# EAGLE design bytexplore_devboard (EAGLE 9.4.2)
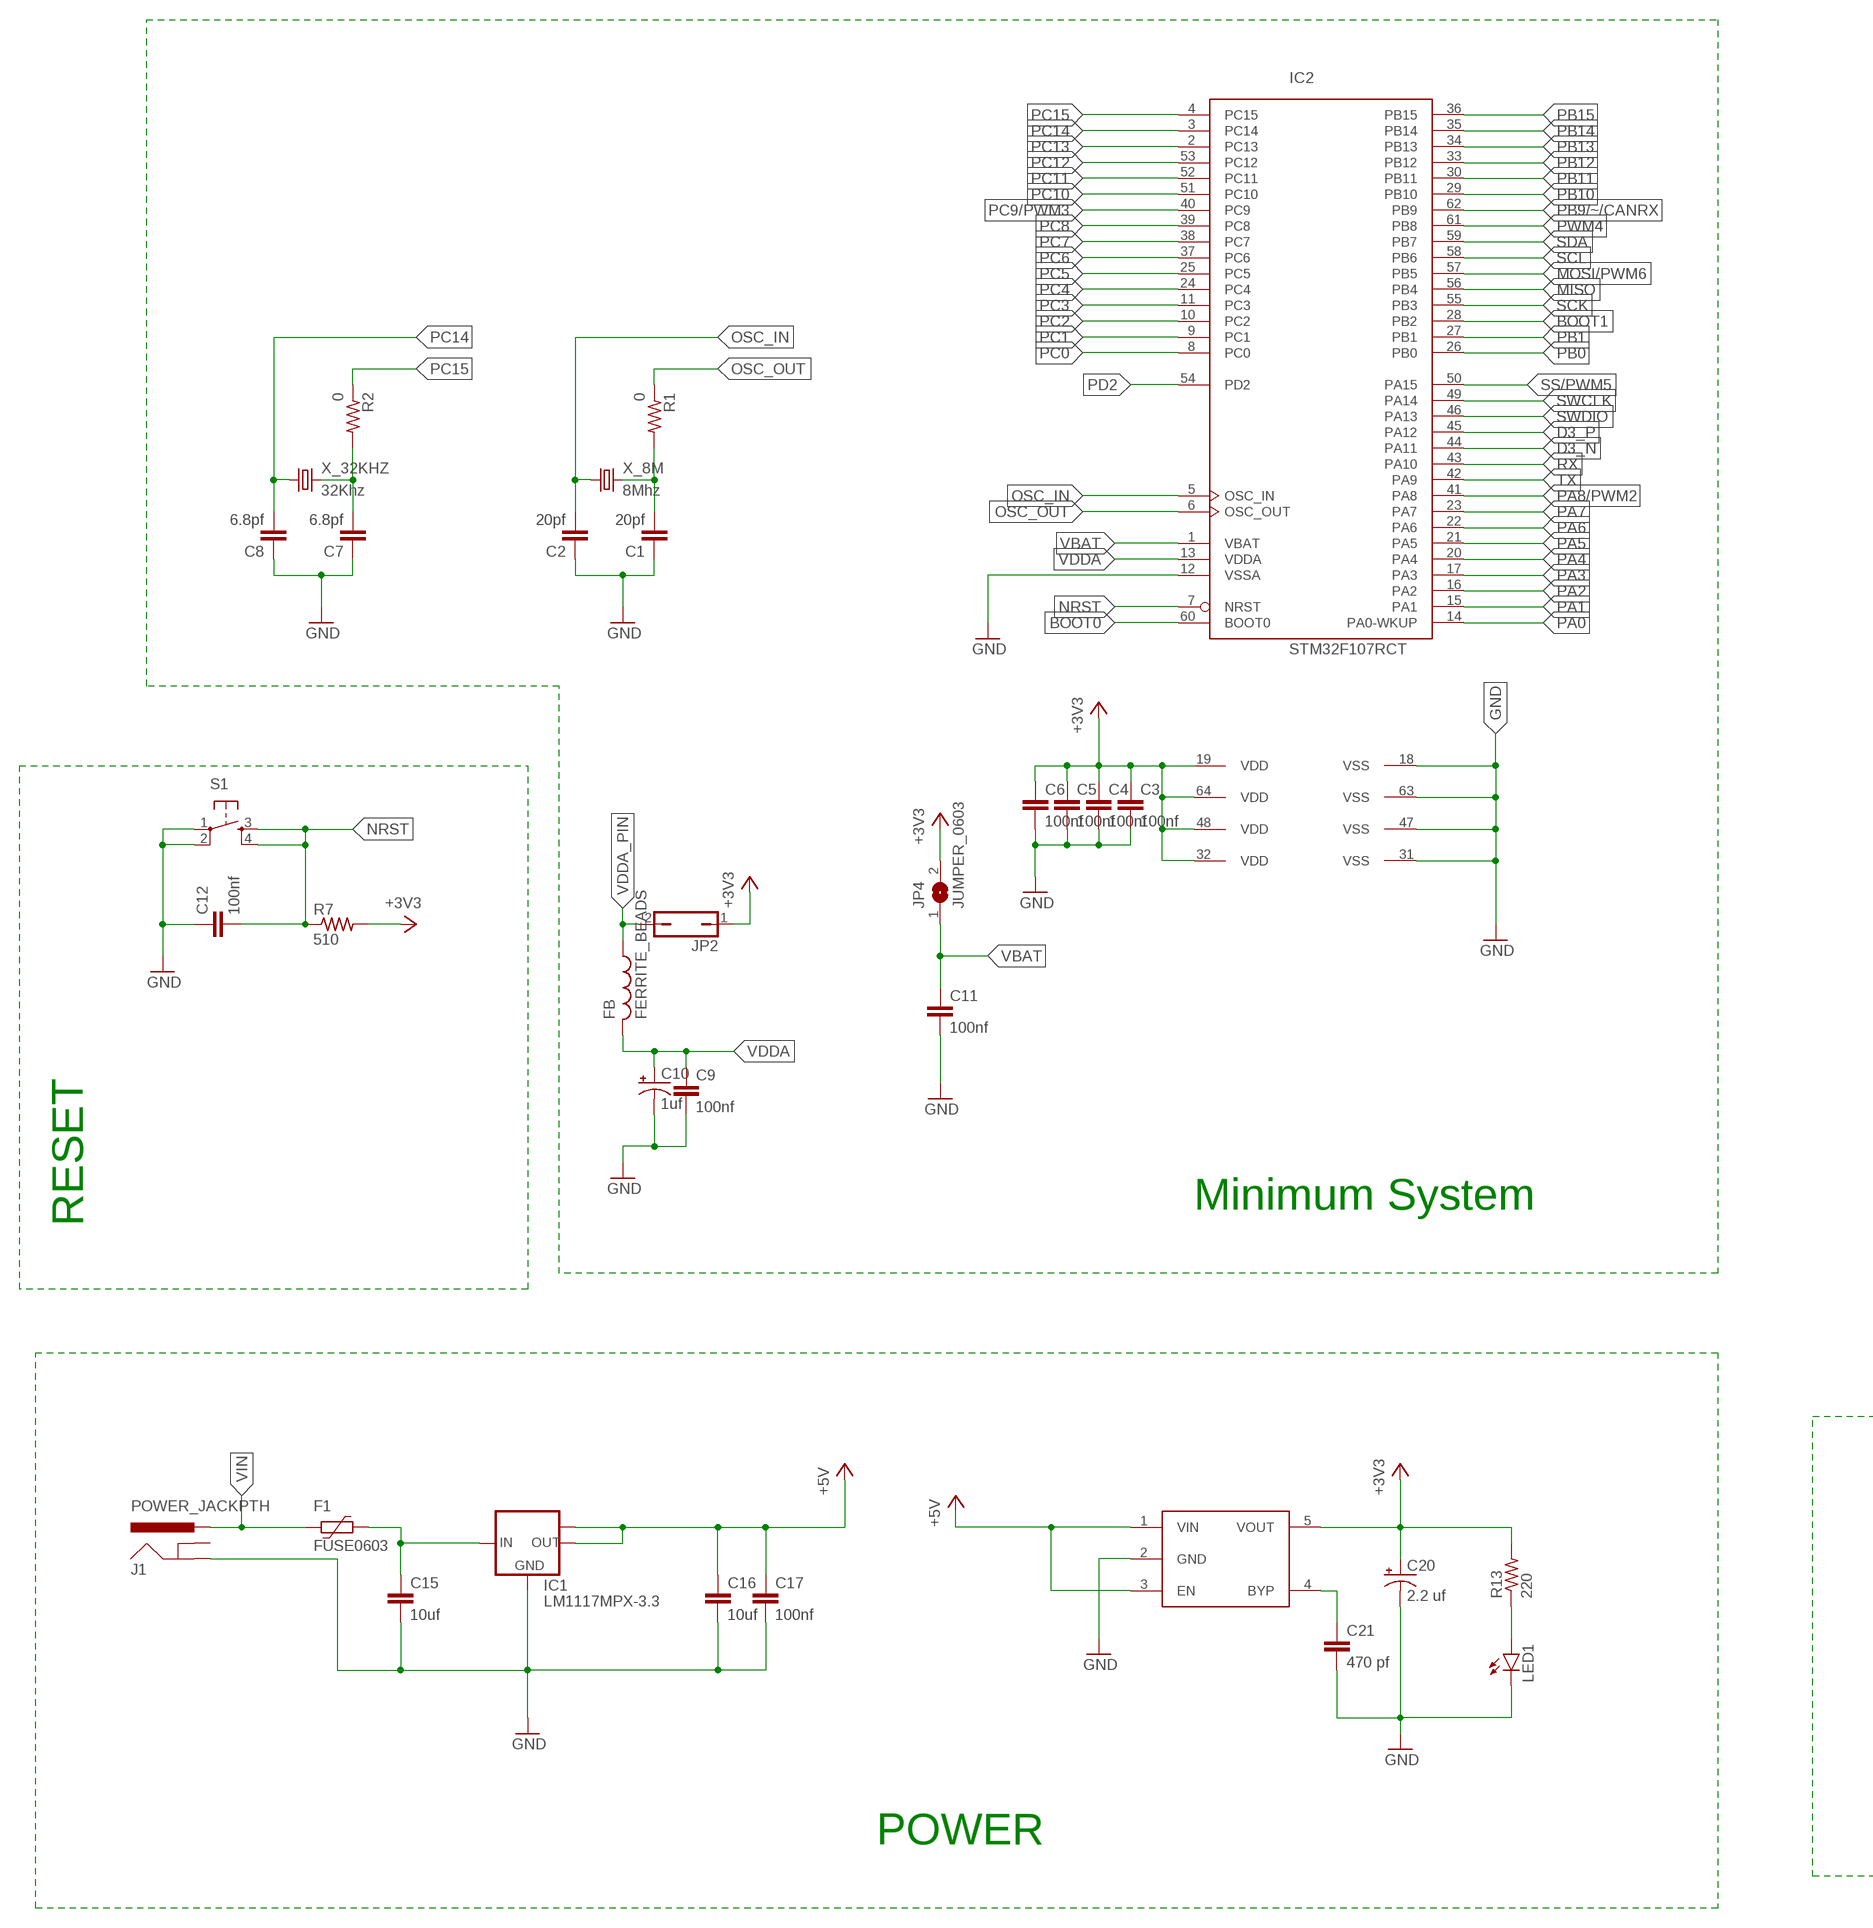
[diagram p0: schematic, sheet 1, part 1 of 2]
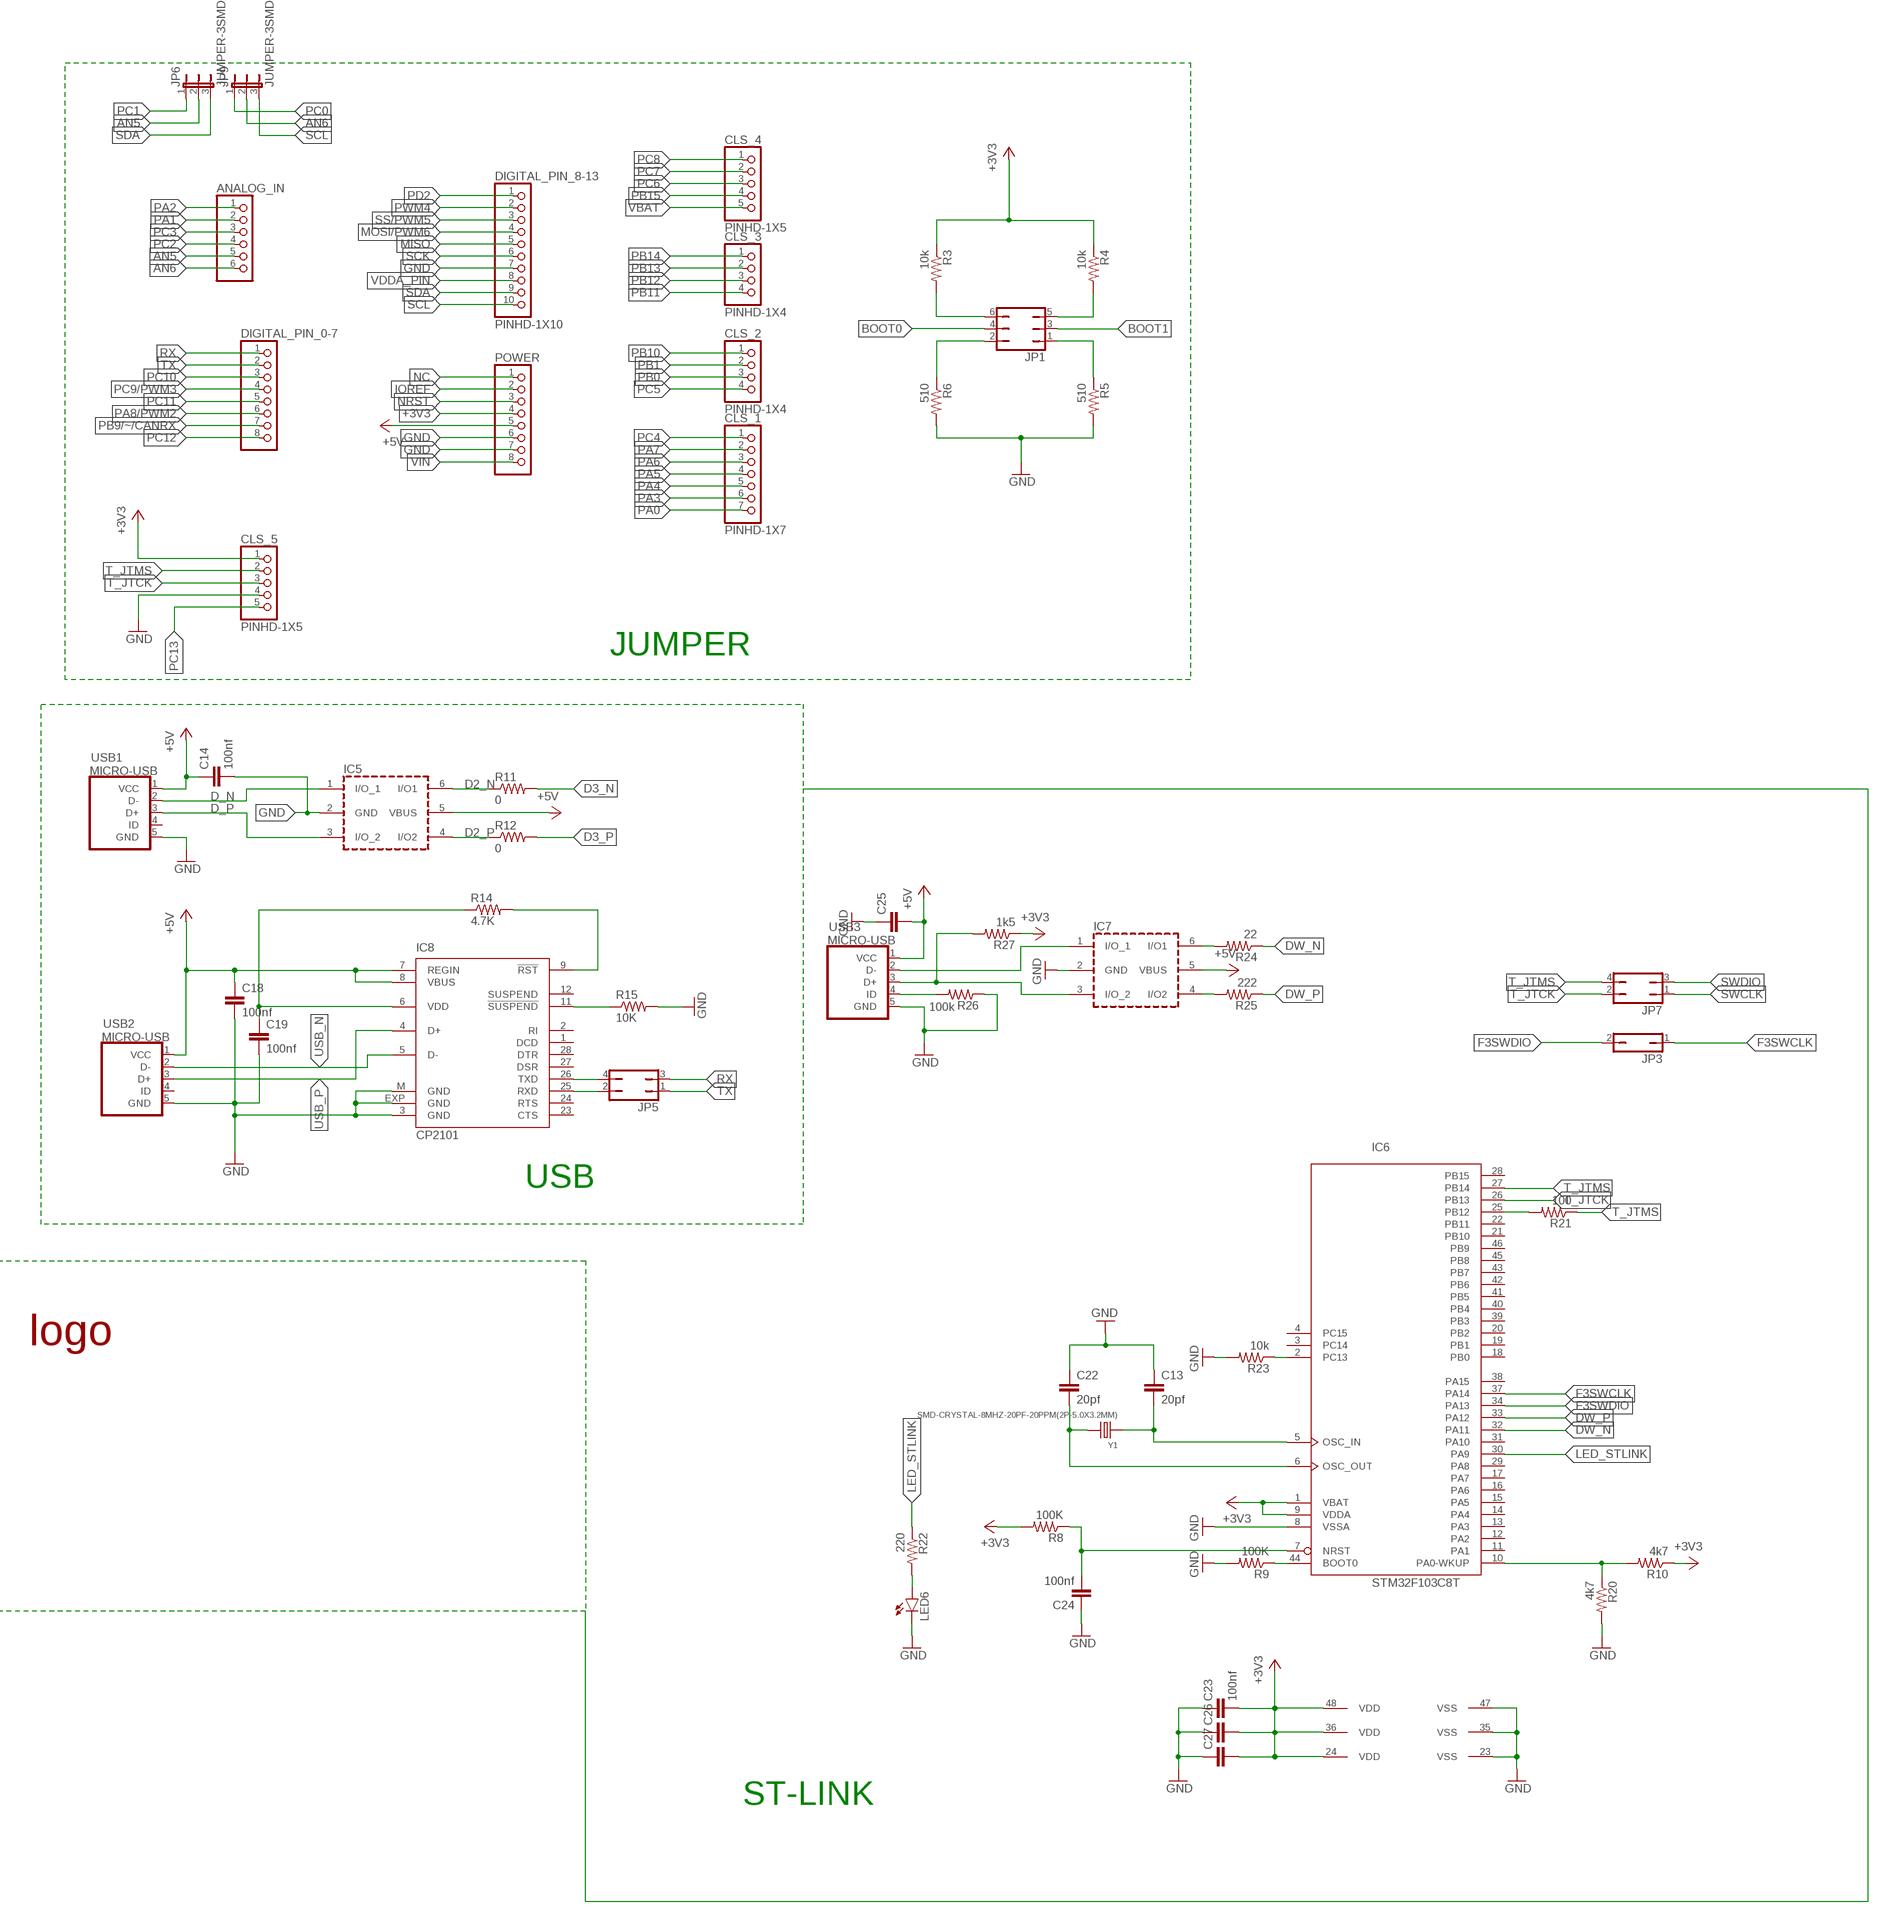
[diagram p1: schematic, sheet 1, part 2 of 2]

## Parts
ANALOG_IN  PINHD-1X6B  [1X06-BIG]
C1  20pf  C-EUC0603K  [C0603K]
C2  20pf  C-EUC0603K  [C0603K]
C3  100nf  C-EUC0603K  [C0603K]
C4  100nf  C-EUC0603K  [C0603K]
C5  100nf  C-EUC0603K  [C0603K]
C6  100nf  C-EUC0603K  [C0603K]
C7  6.8pf  C-EUC0603K  [C0603K]
C8  6.8pf  C-EUC0603K  [C0603K]
C9  100nf  C-EUC0603K  [C0603K]
C10  1uf  CPOL-USSMCB  [SMC_B]
C11  100nf  C-EUC0603K  [C0603K]
C12  100nf  C-EUC0603K  [C0603K]
C13  20pf  C-EUC0603  [C0603]
C14  100nf  C-EUC0603K  [C0603K]
C15  10uf  C-EUC0603  [C0603]
C16  10uf  C-EUC0603  [C0603]
C17  100nf  C-EUC0603  [C0603]
C18  100nf  C-EUC0603K  [C0603K]
C19  100nf  C-EUC0603K  [C0603K]
C20  2.2 uf  CPOL-USSMCA  [SMC_A]
C21  470 pf  C-EUC0603  [C0603]
C22  20pf  C-EUC0603  [C0603]
C23  100nf  C-EUC0603  [C0603]
C24  100nf  C-EUC0603  [C0603]
C25  C-EUC0603  [C0603]
C26  C-EUC0603  [C0603]
C27  C-EUC0603  [C0603]
CLS_1  PINHD-1X7  [1X07-BIG]
CLS_2  PINHD-1X4  [1X04-BIG]
CLS_3  PINHD-1X4  [1X04-BIG]
CLS_4  PINHD-1X5  [1X05-BIG]
CLS_5  PINHD-1X5  [1X05-BIG]
DIGITAL_PIN_0-7  PINHD-1X8BIG  [1X08-BIG]
DIGITAL_PIN_8-13  PINHD-1X10  [1X10-BIG]
F1  FUSE0603  [R0603]
FB  FERRITE_BEADS  [R0603]
IC1  LM1117MPX-3.3  [SOT223]
IC2  STM32F107RCT  [LQFP64]
IC4  MIC5219  [SOT-23-5]
IC5  USBLC6-2SC6  [SOT-23-6L]
IC6  STM32F103C8T  [LQFP48]
IC7  USBLC6-2SC6  [SOT-23-6L]
IC8  CP2101  [MLP28]
J1  POWER_JACKPTH  [POWER_JACK_PTH]
JP1  JP3Q  [JP3Q]
JP2  JP1Q  [JP1]
JP3  JP1Q  [JP1]
JP4  JUMPER_0603  [R0603]
JP5  JP2Q  [JP2Q]
JP6  JUMPER-3SMD  [SJ_3]
JP7  JP2Q  [JP2Q]
JP9  JUMPER-3SMD  [SJ_3]
LED1  LEDSML0603  [SML0603]
LED6  LEDSML0603  [SML0603]
POWER  PINHD-1X8BIG  [1X08-BIG]
R1  0  R-US_R0603  [R0603]
R2  0  R-US_R0603  [R0603]
R3  10k  R-US_R0603  [R0603]
R4  10k  R-US_R0603  [R0603]
R5  510  R-US_R0603  [R0603]
R6  510  R-US_R0603  [R0603]
R7  510  R-US_R0603  [R0603]
R8  100K  R-US_R0603  [R0603]
R9  100K  R-US_R0603  [R0603]
R10  4k7  R-US_R0603  [R0603]
R11  0  R-US_R0603  [R0603]
R12  0  R-US_R0603  [R0603]
R13  220  R-US_R0603  [R0603]
R14  4.7K  R-US_R0603  [R0603]
R15  10K  R-US_R0603  [R0603]
R20  4k7  R-US_R0603  [R0603]
R21  100  R-US_R0603  [R0603]
R22  220  R-US_R0603  [R0603]
R23  10k  R-US_R0603  [R0603]
R24  22  R-US_R0603  [R0603]
R25  222  R-US_R0603  [R0603]
R26  100k  R-US_R0603  [R0603]
R27  1k5  R-US_R0603  [R0603]
S1  TAC_SWITCHPTH  [TACTILE-PTH]
U$1  LOGO_PME2  [LOGO_PME2]
USB1  MICRO-USB  [MICRO-USB]
USB2  MICRO-USB  [MICRO-USB]
USB3  MICRO-USB  [MICRO-USB]
X_8M  8Mhz  CRYSTALHC49U70  [HC49U70]
X_32KHZ  32Khz  CRYSTALTC26H  [TC26H]
Y1  SMD-CRYSTAL-8MHZ-20PF-20PPM(2P-5.0X3.2MM)  [X2-SMD-5.0X3.2X1.3MM]

## Nets
+3V3: C3.1 C4.1 C5.1 C6.1 C20.+ C23.2 C26.2 C27.2 CLS_5.1 IC2.19(VDD) IC2.32(VDD) IC2.48(VDD) IC2.64(VDD) IC4.5(VOUT) IC6.1(VBAT) IC6.9(VDDA) IC6.24(VDD) IC6.36(VDD) IC6.48(VDD) JP2.1 JP4.2 POWER.4 R3.1 R4.1 R7.2 R8.2 R10.1 R13.2 R27.1
+5V: C14.1 C16.1 C17.1 C18.1 C25.2 IC1.2(OUT) IC1.TAB(OUT1) IC4.1(VIN) IC4.3(EN) IC5.5(VBUS) IC7.5(VBUS) IC8.7(REGIN) IC8.8(VBUS) POWER.5 USB1.1(VCC) USB2.1(VCC) USB3.1(VCC)
AN5: ANALOG_IN.5 JP6.2
AN6: ANALOG_IN.6 JP9.2
BOOT0: IC2.60(BOOT0) JP1.4
BOOT1: IC2.28(PB2) JP1.3
D2_N: IC5.6(I/O1) R11.1
D2_P: IC5.4(I/O2) R12.1
D3_N: IC2.44(PA11) R11.2
D3_P: IC2.45(PA12) R12.2
D_N: IC5.1(I/O_1) USB1.2(D-)
D_P: IC5.3(I/O_2) USB1.3(D+)
DW_N: IC6.32(PA11) R24.1
DW_P: IC6.33(PA12) R25.1
F3SWCLK: IC6.37(PA14) JP3.1
F3SWDIO: IC6.34(PA13) JP3.2
GND: C1.1 C2.1 C3.2 C4.2 C5.2 C6.2 C7.1 C8.1 C9.2 C10.- C11.2 C12.1 C13.1 C14.2 C15.2 C16.2 C17.2 C18.2 C19.2 C20.- C21.2 C22.1 C23.1 C24.1 C25.1 C26.1 C27.1 CLS_5.4 DIGITAL_PIN_8-13.7 IC1.1(GND) IC2.12(VSSA) IC2.18(VSS) IC2.31(VSS) IC2.47(VSS) IC2.63(VSS) IC4.2(GND) IC5.2(GND) IC6.8(VSSA) IC6.23(VSS) IC6.35(VSS) IC6.47(VSS) IC7.2(GND) IC8.3(GND) IC8.EXP(GND) IC8.M(GND) J1.GND LED1.C LED6.C POWER.6 POWER.7 R5.2 R6.2 R9.2 R15.2 R20.2 R23.2 R26.1 S1.1 S1.2 USB1.5(GND) USB2.5(GND) USB3.5(GND)
IOREF: POWER.2
LED_STLINK: IC6.30(PA9) R22.1
MISO: DIGITAL_PIN_8-13.5 IC2.56(PB4)
MOSI/PWM6: DIGITAL_PIN_8-13.4 IC2.57(PB5)
N$1: JP1.5 R4.2
N$2: C1.2 R1.2 X_8M.2
N$3: JP1.6 R3.2
N$4: C7.2 R2.2 X_32KHZ.2
N$5: C19.1 IC8.6(VDD) R14.1
N$6: C13.2 IC6.5(OSC_IN) Y1.1
N$7: C24.2 IC6.7(NRST) R8.1
N$8: C22.2 IC6.6(OSC_OUT) Y1.2
N$9: C15.1 F1.1 IC1.3(IN)
N$10: IC6.44(BOOT0) R9.1
N$11: LED1.A R13.1
N$12: IC6.10(PA0-WKUP) R10.2 R20.1
N$13: IC6.25(PB12) R21.2
N$14: LED6.A R22.2
N$15: IC6.2(PC13) R23.1
N$16: IC8.9(!RST) R14.2
N$17: IC8.11(!SUSPEND) R15.1
N$18: IC7.6(I/O1) R24.2
N$19: IC8.26(TXD) JP5.4
N$20: IC8.25(RXD) JP5.2
N$21: IC7.4(I/O2) R25.2
N$23: IC7.1(I/O_1) USB3.2(D-)
N$33: JP1.1 R5.1
N$34: JP1.2 R6.1
N$40: IC7.3(I/O_2) R27.2 USB3.3(D+)
N$45: R26.2 USB3.4(ID)
N$55: C21.1 IC4.4(BYP)
NC: POWER.1
NRST: C12.2 IC2.7(NRST) POWER.3 R7.1 S1.3 S1.4
OSC_IN: C2.2 IC2.5(OSC_IN) X_8M.1
OSC_OUT: IC2.6(OSC_OUT) R1.1
PA0: CLS_1.7 IC2.14(PA0-WKUP)
PA1: ANALOG_IN.2 IC2.15(PA1)
PA2: ANALOG_IN.1 IC2.16(PA2)
PA3: CLS_1.6 IC2.17(PA3)
PA4: CLS_1.5 IC2.20(PA4)
PA5: CLS_1.4 IC2.21(PA5)
PA6: CLS_1.3 IC2.22(PA6)
PA7: CLS_1.2 IC2.23(PA7)
PA8/PWM2: DIGITAL_PIN_0-7.6 IC2.41(PA8)
PB0: CLS_2.3 IC2.26(PB0)
PB1: CLS_2.2 IC2.27(PB1)
PB9/~/CANRX: DIGITAL_PIN_0-7.7 IC2.62(PB9)
PB10: CLS_2.1 IC2.29(PB10)
PB11: CLS_3.4 IC2.30(PB11)
PB12: CLS_3.3 IC2.33(PB12)
PB13: CLS_3.2 IC2.34(PB13)
PB14: CLS_3.1 IC2.35(PB14)
PB15: CLS_4.4 IC2.36(PB15)
PC0: IC2.8(PC0) JP9.1
PC1: IC2.9(PC1) JP6.1
PC2: ANALOG_IN.4 IC2.10(PC2)
PC3: ANALOG_IN.3 IC2.11(PC3)
PC4: CLS_1.1 IC2.24(PC4)
PC5: CLS_2.4 IC2.25(PC5)
PC6: CLS_4.3 IC2.37(PC6)
PC7: CLS_4.2 IC2.38(PC7)
PC8: CLS_4.1 IC2.39(PC8)
PC9/PWM3: DIGITAL_PIN_0-7.4 IC2.40(PC9)
PC10: DIGITAL_PIN_0-7.3 IC2.51(PC10)
PC11: DIGITAL_PIN_0-7.5 IC2.52(PC11)
PC12: DIGITAL_PIN_0-7.8 IC2.53(PC12)
PC13: CLS_5.5 IC2.2(PC13)
PC14: C8.2 IC2.3(PC14) X_32KHZ.1
PC15: IC2.4(PC15) R2.1
PD2: DIGITAL_PIN_8-13.1 IC2.54(PD2)
PWM4: DIGITAL_PIN_8-13.2 IC2.61(PB8)
RX: DIGITAL_PIN_0-7.1 IC2.43(PA10) JP5.3
SCK: DIGITAL_PIN_8-13.6 IC2.55(PB3)
SCL: DIGITAL_PIN_8-13.10 IC2.58(PB6) JP9.3
SDA: DIGITAL_PIN_8-13.9 IC2.59(PB7) JP6.3
SS/PWM5: DIGITAL_PIN_8-13.3 IC2.50(PA15)
SWCLK: IC2.49(PA14) JP7.1
SWDIO: IC2.46(PA13) JP7.3
T_JTCK: CLS_5.3 IC6.26(PB13) JP7.2
T_JTMS: CLS_5.2 IC6.27(PB14) JP7.4 R21.1
TX: DIGITAL_PIN_0-7.2 IC2.42(PA9) JP5.1
USB_N: IC8.5(D-) USB2.2(D-)
USB_P: IC8.4(D+) USB2.3(D+)
VBAT: C11.1 CLS_4.5 IC2.1(VBAT) JP4.1
VDDA: C9.1 C10.+ FB.2 IC2.13(VDDA)
VDDA_PIN: DIGITAL_PIN_8-13.8 FB.1 JP2.2
VIN: F1.2 J1.PWR POWER.8
Unconnected: IC6.3(PC14) IC6.4(PC15) IC6.11(PA1) IC6.12(PA2) IC6.13(PA3) IC6.14(PA4) IC6.15(PA5) IC6.16(PA6) IC6.17(PA7) IC6.18(PB0) IC6.19(PB1) IC6.20(PB2) IC6.21(PB10) IC6.22(PB11) IC6.28(PB15) IC6.29(PA8) IC6.31(PA10) IC6.38(PA15) IC6.39(PB3) IC6.40(PB4) IC6.41(PB5) IC6.42(PB6) IC6.43(PB7) IC6.45(PB8) IC6.46(PB9) IC8.1(DCD) IC8.2(RI) IC8.12(SUSPEND) IC8.23(CTS) IC8.24(RTS) IC8.27(DSR) IC8.28(DTR) J1.GNB(GNDBREAK) USB1.4(ID) USB2.4(ID)

## Notes on the sheet
- JUMPER
- Minimum System
- RESET
- USB
- POWER
- ST-LINK

## Library data of the parts
ANALOG_IN = adafruit:PINHD-1X6: PIN HEADER
C1-C9 C11-C19 C21-C27 = rcl:C-EU: CAPACITOR, European symbol; SPICEPREFIX: C
C10 C20 = rcl:CPOL-US: POLARIZED CAPACITOR, American symbol; SPICEPREFIX: C
CLS_1 = adafruit:PINHD-1X7
CLS_2 CLS_3 = adafruit:PINHD-1X4
CLS_4 CLS_5 = adafruit:PINHD-1X5
DIGITAL_PIN_0-7 POWER = adafruit:PINHD-1X8: PIN HEADER
DIGITAL_PIN_8-13 = adafruit:PINHD-1X10: Pin header 1x10 0.1" spacing With round pins
F1 = Custom:FUSE0603
FB = Custom:FERRITE_BEADS
IC1 = lm1117:LM1117MPX-*
IC2 = micro-stm_v2:STM32F107R*T: ARM 32-bit Cortex™-M3 CPU 72 MHz maximum frequency 128 to 256 Kbytes of Flash memory 64 kbytes of SRAM 51 GPIOs 2.0 to 3.6 V application supply
IC4 = Custom:MIC5219
IC5 IC7 = usblc6:USBLC6-2: VERY LOW CAPACITANCE ESD PROTECTION 2 line Datasheet link <http://www.st.com/web/catalog/sense_power/FM114/CL1137/SC1489/PF93353>
IC6 = micro-stm_v2:STM32F103C*T: ARM 32-bit Cortex™-M3 CPU 72 MHz maximum frequency 16 to 128 Kbytes of Flash memory 6 to 20 kbytes of SRAM 37 GPIOs 2.0 to 3.6 V application supply
IC8 = silabs-2:CP210*: Single-Chip USB to UART Bridge Source: www.silabs.com .. CP2101.pdf / cp2102.pdf
J1 = SparkFun:POWER_JACK: Power Jack This is the standard 5.5mm barrel jack for power. The PTH is the most common, proven, reliable, footprint. All others are experimental. The Slot footprint only works if the mill layer is transmitted to the PCB fab house so be warned. Spark Fun Electronics SKU : PRT-00119. Mating wall wart : TOL-00298 (and others)
JP1 = jumper:JP3Q: JUMPER
JP2 JP3 = jumper:JP1Q: JUMPER
JP4 = Custom:JUMPER_0603
JP5 JP7 = jumper:JP2Q: JUMPER
JP6 JP9 = SparkFun:JUMPER-3
LED1 LED6 = led:LED: LED OSRAM: - CHIPLED LG R971, LG N971, LY N971, LG Q971, LY Q971, LO R971, LY R971 LH N974, LH R974 LS Q976, LO Q976, LY Q976 LO Q996 - Hyper CHIPLED LW Q18S LB Q993, LB Q99A, LB R99A - SideLED LS A670, LO A670, LY A670, LG A670, LP A670 LB A673, LV A673, LT A673, LW A673 LH A674 LY A675 LS A676, LA A676, LO A676, LY A676, LW A676 LS A679, LY A679, LG A679 - Hyper Micro SIDELED® LS Y876, LA Y876, LO Y876, LY Y876 LT Y87S - SmartLED LW L88C, LW L88S LB L89C, LB L89S, LG L890 LS L89K, LO L89K, LY L89K LS L896, LA L896, LO L896, LY L896 - TOPLED LS T670, LO T670, LY T670, LG T670, LP T670 LSG T670, LSP T670, LSY T670, LOP T670, LYG T670 LG T671, LOG T671, LSG T671 LB T673, LV T673, LT T673, LW T673 LH T674 LS T676, LA T676, LO T676, LY T676, LB T676, LH T676, LSB T676, LW T676 LB T67C, LV T67C, LT T67C, LS T67K, LO T67K, LY T67K, LW E67C LS E67B, LA E67B, LO E67B, LY E67B, LB E67C, LV E67C, LT E67C LW T67C LS T679, LY T679, LG T679 LS T770, LO T770, LY T770, LG T770, LP T770 LB T773, LV T773, LT T773, LW T773 LH T774 LS E675, LA E675, LY E675, LS T675 LS T776, LA T776, LO T776, LY T776, LB T776 LHGB T686 LT T68C, LB T68C - Hyper Mini TOPLED® LB M676 - Mini TOPLED Santana® LG M470 LS M47K, LO M47K, LY M47K Source: http://www.osram.convergy.de LUXEON: - LUMILED® LXK2-PW12-R00, LXK2-PW12-S00, LXK2-PW14-U00, LXK2-PW14-V00 LXK2-PM12-R00, LXK2-PM12-S00, LXK2-PM14-U00 LXK2-PE12-Q00, LXK2-PE12-R00, LXK2-PE12-S00, LXK2-PE14-T00, LXK2-PE14-U00 LXK2-PB12-K00, LXK2-PB12-L00, LXK2-PB12-M00, LXK2-PB14-N00, LXK2-PB14-P00, LXK2-PB14-Q00 LXK2-PR12-L00, LXK2-PR12-M00, LXK2-PR14-Q00, LXK2-PR14-R00 LXK2-PD12-Q00, LXK2-PD12-R00, LXK2-PD12-S00 LXK2-PH12-R00, LXK2-PH12-S00 LXK2-PL12-P00, LXK2-PL12-Q00, LXK2-PL12-R00 Source: www.luxeon.com KINGBRIGHT: KA-3528ASYC Source: www.kingbright.com
R1-R15 R20-R27 = rcl:R-US_: RESISTOR, American symbol; SPICEPREFIX: R
S1 = SparkFun:TAC_SWITCH: Momentary Switch Button commonly used for reset or general input. Spark Fun Electronics SKU : COM-00097
U$1 = Custom:LOGO_PME
USB1-USB3 = microusb:MICRO-USB: Micro USB B connector
X_8M X_32KHZ = adafruit:CRYSTAL: CRYSTAL; OC_FARNELL: unknown; OC_NEWARK: unknown
Y1 = SMD-CRYSTAL-8MHZ-20PF-20PPM_2P-5.0X3.2MM_:SMD-CRYSTAL-8MHZ-20PF-20PPM(2P-5.0X3.2MM): 306010004; AVAILABILITY: Unavailable; DESCRIPTION: SMD Crystal 8MHz-20pF-20ppm;; MF: Xinhunjing; MP: 5032/4P; PACKAGE: None; PRICE: None

## Board
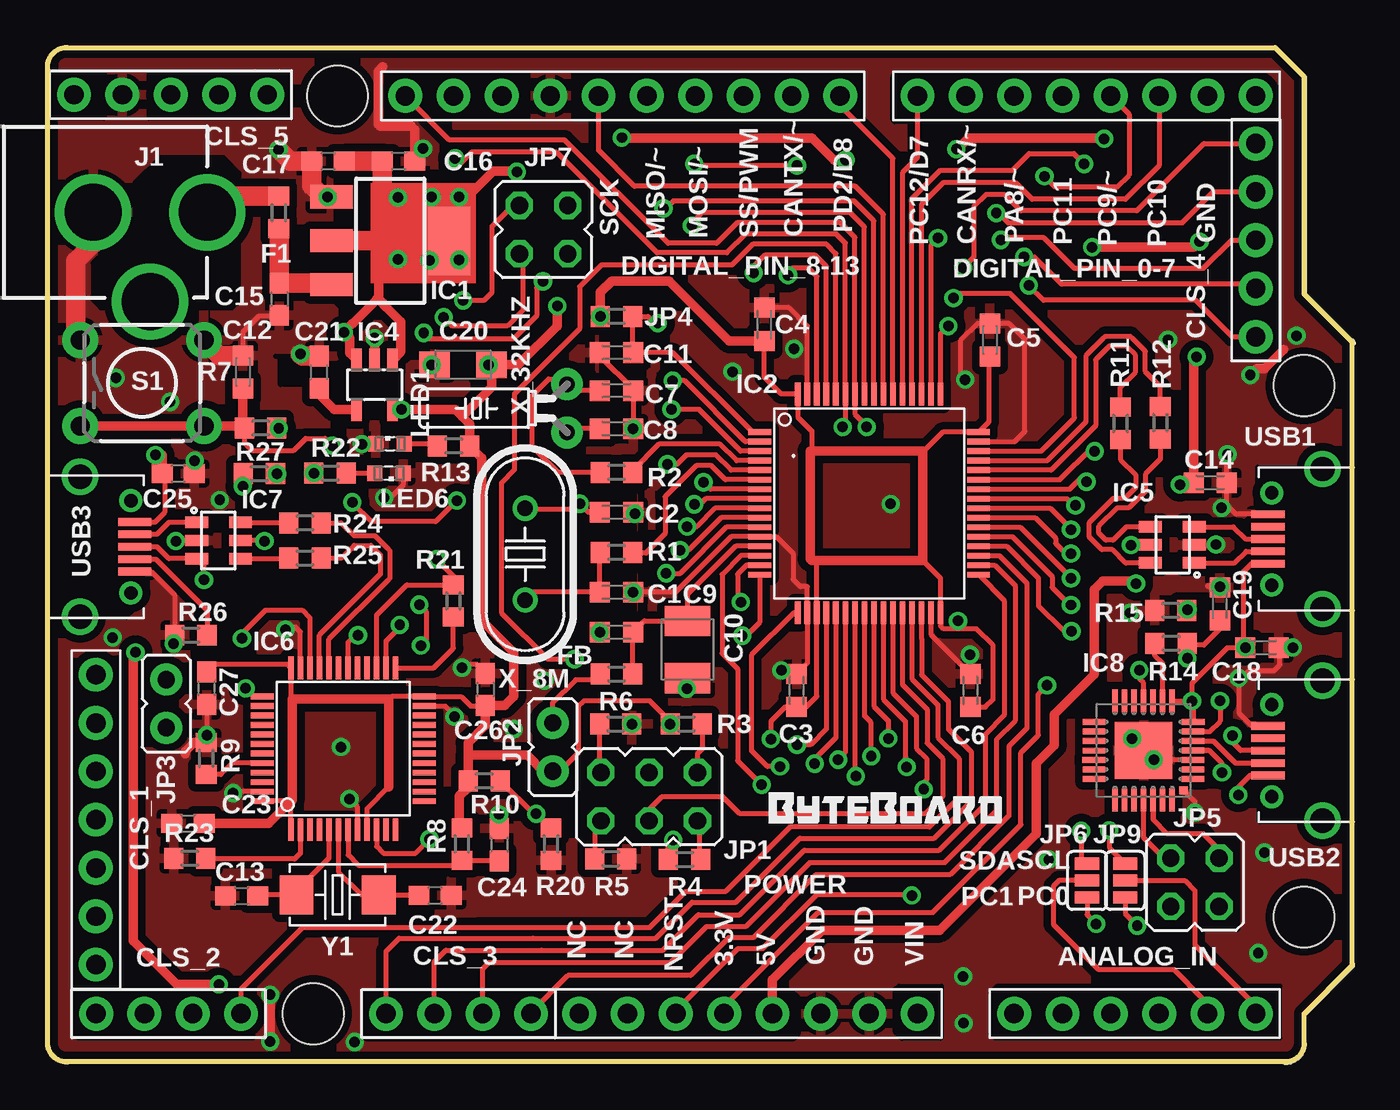
[diagram p2: board, top side]
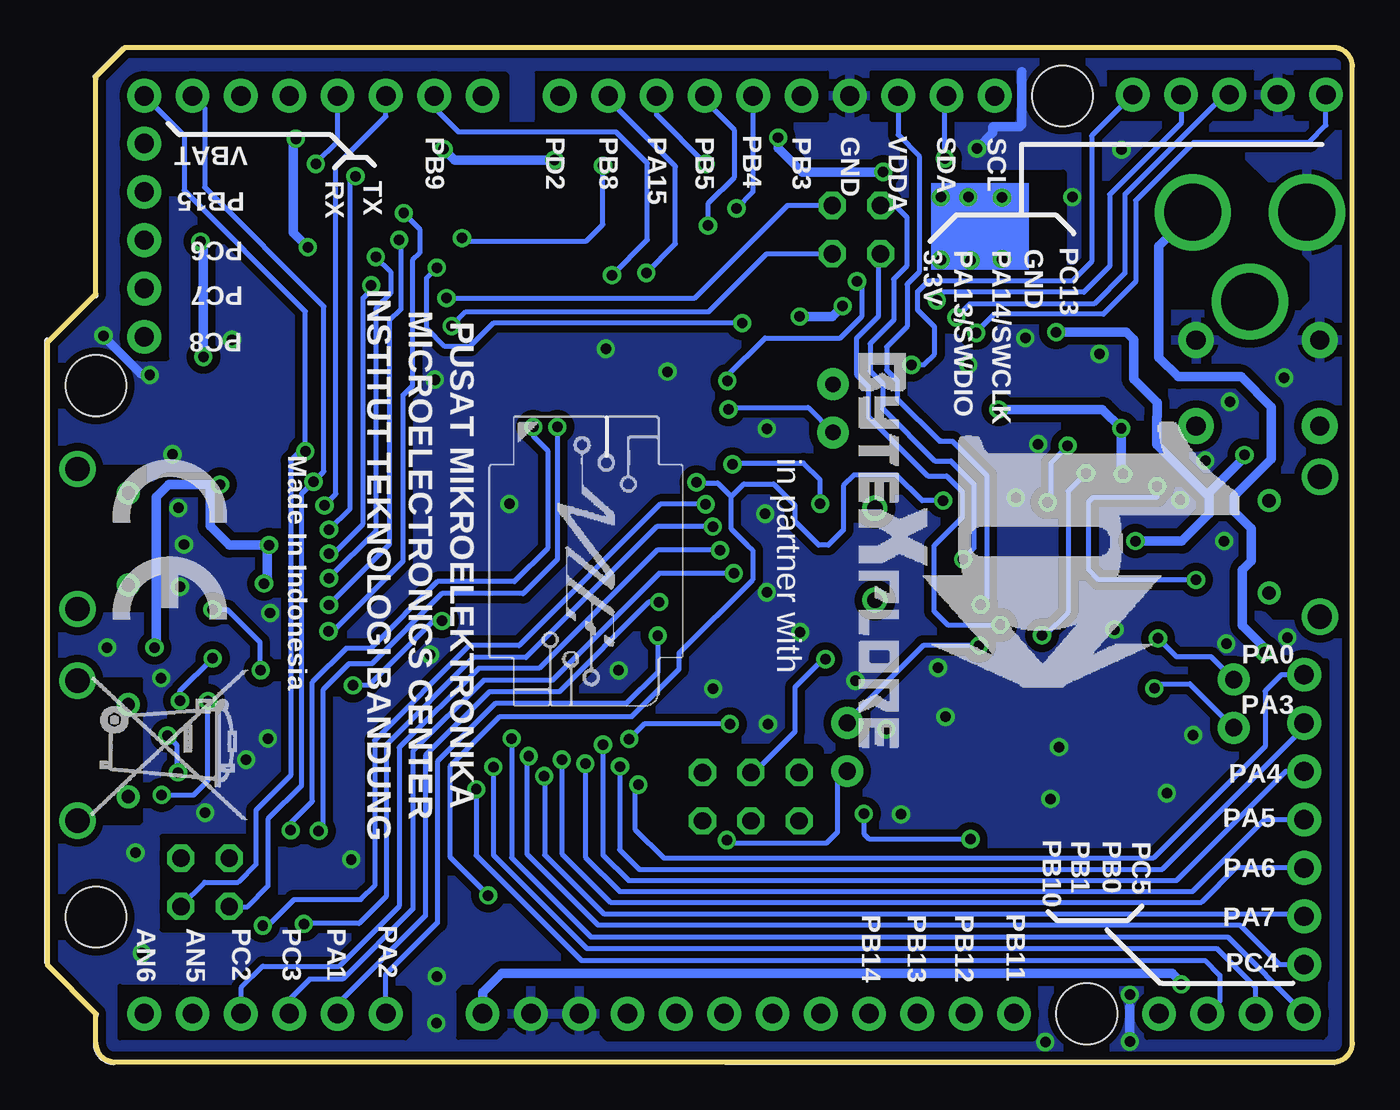
[diagram p3: board, bottom side, seen from below]

Size 68.58 x 53.34 mm. Coordinates in mm from the lower left corner, seen from the top.
Outline: 1,53.34 64.52,53.34 66.04,51.82 66.04,40.39 68.58,37.85 68.58,5.08 66.04,2.54 66.04,1 arc-90 65.04,0 1,0 arc-90 0,1 0,52.34 arc-90 1,53.34
Copper layers (1*16): Top 0.035mm / dielectric 5.5mm / Bottom 0.035mm
Design rules "default *": minimum track width 0.25mm, minimum drill 0.55mm, track to track 0.25mm, track to pad 0.25mm, pad to pad 0.25mm, via to via 0.25mm, smd to smd 0.25mm, copper to edge 0.25mm, drill to drill 6mil, minimum pad ring 10mil, minimum via ring 8mil, stop-mask expansion 4mil, vias tented up to drill 6mm, thermal gap 10mil
Holes 3.2 mm at 15.24,50.8 13.97,2.54 66.04,35.56 66.04,7.62

### Footprints (pad centres in the part's own frame; a part is rotated, then mirrored left to right if it is on the bottom)
1X06-BIG = drill 1.016 pad 1.778: 1 -6.35,0; 2 -3.81,0; 3 -1.27,0; 4 1.27,0; 5 3.81,0; 6 6.35,0
C0603K = smd 1.05 x 1.08: 1 -0.875,0; 2 0.875,0
SMC_B = smd 1.6 x 2.4: + -1.5,0; - 1.5,0
C0603 = smd 1.1 x 1: 1 -0.85,0; 2 0.85,0
SMC_A = smd 1.6 x 1.4: + -1.5,0; - 1.5,0
1X07-BIG = drill 1.016 pad 1.778: 1 -7.62,0; 2 -5.08,0; 3 -2.54,0; 4 0,0; 5 2.54,0; 6 5.08,0; 7 7.62,0
1X04-BIG = drill 1.016 pad 1.778: 1 0,0; 2 2.54,0; 3 5.08,0; 4 7.62,0
1X05-BIG = drill 1.016 pad 1.778: 1 -6.35,0; 2 -3.81,0; 3 -1.27,0; 4 1.27,0; 5 3.81,0
1X08-BIG = drill 1.016 pad 1.778: 1 -8.89,0; 2 -6.35,0; 3 -3.81,0; 4 -1.27,0; 5 1.27,0; 6 3.81,0; 7 6.35,0; 8 8.89,0
1X10-BIG = drill 1.016 pad 1.778: 1 -11.43,0; 2 -8.89,0; 3 -6.35,0; 4 -3.81,0; 5 -1.27,0; 6 1.27,0; 7 3.81,0; 8 6.35,0; 9 8.89,0; 10 11.43,0
R0603 = smd 1 x 1.1: 1 -0.85,0; 2 0.85,0
SOT223 = smd 1.219 x 2.235: 1 -2.311,-3.099; 2 0,-3.099; 3 2.311,-3.099 | smd 3.6 x 2.2: TAB 0,3.099
LQFP64 = smd 0.3 x 1.2: 1 -3.75,-5.75; 2 -3.25,-5.75; 3 -2.75,-5.75; 4 -2.25,-5.75; 5 -1.75,-5.75; 6 -1.25,-5.75; 7 -0.75,-5.75; 8 -0.25,-5.75; 9 0.25,-5.75; 10 0.75,-5.75; 11 1.25,-5.75; 12 1.75,-5.75; 13 2.25,-5.75; 14 2.75,-5.75; 15 3.25,-5.75; 16 3.75,-5.75; 33 3.75,5.75; 34 3.25,5.75; 35 2.75,5.75; 36 2.25,5.75; 37 1.75,5.75; 38 1.25,5.75; 39 0.75,5.75; 40 0.25,5.75; 41 -0.25,5.75; 42 -0.75,5.75; 43 -1.25,5.75; 44 -1.75,5.75; 45 -2.25,5.75; 46 -2.75,5.75; 47 -3.25,5.75; 48 -3.75,5.75 | smd 1.2 x 0.3: 17 5.75,-3.75; 18 5.75,-3.25; 19 5.75,-2.75; 20 5.75,-2.25; 21 5.75,-1.75; 22 5.75,-1.25; 23 5.75,-0.75; 24 5.75,-0.25; 25 5.75,0.25; 26 5.75,0.75; 27 5.75,1.25; 28 5.75,1.75; 29 5.75,2.25; 30 5.75,2.75; 31 5.75,3.25; 32 5.75,3.75; 49 -5.75,3.75; 50 -5.75,3.25; 51 -5.75,2.75; 52 -5.75,2.25; 53 -5.75,1.75; 54 -5.75,1.25; 55 -5.75,0.75; 56 -5.75,0.25; 57 -5.75,-0.25; 58 -5.75,-0.75; 59 -5.75,-1.25; 60 -5.75,-1.75; 61 -5.75,-2.25; 62 -5.75,-2.75; 63 -5.75,-3.25; 64 -5.75,-3.75
SOT-23-5 = smd 0.55 x 1.2: 1 -0.95,-1.3; 2 0,-1.3; 3 0.95,-1.3; 4 0.95,1.3; 5 -0.95,1.3
SOT-23-6L = smd 0.6 x 1.2: 1 -0.95,-2.3; 2 0,-2.3; 3 0.95,-2.3; 4 0.95,0; 5 0,0; 6 -0.95,0
LQFP48 = smd 0.3 x 1.2: 1 -2.75,-4.25; 2 -2.25,-4.25; 3 -1.75,-4.25; 4 -1.25,-4.25; 5 -0.75,-4.25; 6 -0.25,-4.25; 7 0.25,-4.25; 8 0.75,-4.25; 9 1.25,-4.25; 10 1.75,-4.25; 11 2.25,-4.25; 12 2.75,-4.25; 25 2.75,4.25; 26 2.25,4.25; 27 1.75,4.25; 28 1.25,4.25; 29 0.75,4.25; 30 0.25,4.25; 31 -0.25,4.25; 32 -0.75,4.25; 33 -1.25,4.25; 34 -1.75,4.25; 35 -2.25,4.25; 36 -2.75,4.25 | smd 1.2 x 0.3: 13 4.25,-2.75; 14 4.25,-2.25; 15 4.25,-1.75; 16 4.25,-1.25; 17 4.25,-0.75; 18 4.25,-0.25; 19 4.25,0.25; 20 4.25,0.75; 21 4.25,1.25; 22 4.25,1.75; 23 4.25,2.25; 24 4.25,2.75; 37 -4.25,2.75; 38 -4.25,2.25; 39 -4.25,1.75; 40 -4.25,1.25; 41 -4.25,0.75; 42 -4.25,0.25; 43 -4.25,-0.25; 44 -4.25,-0.75; 45 -4.25,-1.25; 46 -4.25,-1.75; 47 -4.25,-2.25; 48 -4.25,-2.75
MLP28 = smd 1.2 x 0.3: 1 -2.601,1.5; 2 -2.601,1; 3 -2.6,0.5; 4 -2.6,0; 5 -2.602,-0.499; 6 -2.6,-1.001; 7 -2.605,-1.503; 15 2.599,-1.504; 16 2.601,-1.002; 17 2.602,-0.5; 18 2.6,0.003; 19 2.607,0.495; 20 2.603,1; 21 2.607,1.5 | smd 0.3 x 1.2: 8 -1.5,-2.602; 9 -1,-2.599; 10 -0.503,-2.605; 11 -0.003,-2.601; 12 0.501,-2.601; 13 1.003,-2.598; 14 1.498,-2.601; 22 1.502,2.603; 23 1,2.598; 24 0.499,2.602; 25 0.001,2.603; 26 -0.5,2.602; 27 -1.001,2.602; 28 -1.501,2.603 | smd 3 x 3: EXP 0,0 | smd 0.435 x 0.435: M -2.103,2.103
POWER_JACK_PTH = drill 2.997: GNB 4.7,10.7; GND 0,7.7; PWR 0,13.7
JP3Q = drill 0.914 octagon: 1 -2.54,-1.27; 2 -2.54,1.27; 3 0,-1.27; 4 0,1.27; 5 2.54,-1.27; 6 2.54,1.27
JP1 = drill 0.914 pad 1.676: 1 0,-1.27; 2 0,1.27
JP2Q = drill 0.914 octagon: 1 -1.27,-1.27; 2 -1.27,1.27; 3 1.27,-1.27; 4 1.27,1.27
SJ_3 = smd 0.635 x 1.27: 1 -0.889,0; 2 0,0; 3 0.889,0
SML0603 = smd 0.8 x 0.8: A 0.75,0; C -0.75,0
TACTILE-PTH = drill 1.016 pad 1.88: 1 -3.251,2.261; 2 3.251,2.261; 3 -3.251,-2.261; 4 3.251,-2.261
MICRO-USB = smd 0.4 x 1.75: 1 -1.3,4.525; 2 -0.65,4.525; 3 0,4.525; 4 0.65,4.525; 5 1.3,4.525 | drill 1.27: P$1 -3.678,1.651; P$2 3.678,1.651 | drill 0.7 pad 1.143: P$3 -2.425,4.318; P$5 2.425,4.318
HC49U70 = drill 0.813: 1 -2.413,0; 2 2.413,0
TC26H = drill 0.813 pad 1.676: 1 -1.27,0; 2 1.27,0
X2-SMD-5.0X3.2X1.3MM = smd 1.778 x 2.032: 1 -2.159,0; 2 2.159,0

### Placement (x,y rotation side)
ANALOG_IN  57.15,2.54 0 top
C1  29.9,24.7 180 top
C2  29.9,28.9 180 top
C3  39.37,19.54 90 top
C4  37.67,38.78 90 top
C5  49.53,37.96 90 top
C6  48.5,19.54 90 top
C7  29.9,35.3 180 top
C8  29.9,33.3 180 top
C9  29.9,22.6 180 top
C10  33.63,21.69 270 top
C11  29.9,37.3 180 top
C12  10.27,36.28 270 top
C13  10.2,8.73 0 top
C14  61.11,30.46 0 top
C15  12.18,40.11 270 top
C16  18.45,47.37 0 top
C17  14.74,47.36 180 top
C18  63.83,21.79 0 top
C19  61.61,24.08 90 top
C20  21.84,36.66 180 top
C21  14.28,36.27 90 top
C22  20.37,8.76 180 top
C23  7.38,12.54 0 top
C24  23.73,11.43 270 top
C25  6.87,30.93 180 top
C26  23.01,19.59 270 top
C27  8.37,19.65 90 top
CLS_1  2.54,12.74 90 top
CLS_2  10.17,2.54 180 top
CLS_3  25.41,2.54 180 top
CLS_4  63.5,44.48 90 top
CLS_5  5.2,50.86 180 top
DIGITAL_PIN_0-7  54.61,50.8 180 top
DIGITAL_PIN_8-13  30.23,50.8 180 top
F1  12.15,44.67 90 top
FB  29.9,20.4 0 top
IC1  18.01,43.18 270 top
IC2  43.18,29.37 270 top
IC4  17.19,35.61 180 top
IC5  57.96,27.19 90 top
IC6  15.54,16.47 0 top
IC7  10.14,27.42 270 top
IC8  57.6,16.38 180 top
J1  -5.31,44.68 270 top
JP1  31.62,13.95 0 top
JP2  26.55,16.56 0 top
JP3  6.24,18.84 0 top
JP4  29.9,39.2 180 top
JP5  60.3,9.45 0 top
JP6  54.63,9.54 90 top
JP7  26.07,43.77 90 top
JP9  56.64,9.54 90 top
LED1  18,32.51 0 top
LED6  17.94,30.96 180 top
POWER  36.83,2.54 0 top
R1  29.9,26.8 180 top
R2  29.9,31 180 top
R3  33.57,17.77 0 top
R4  33.48,10.65 0 top
R5  29.6,10.68 0 top
R6  29.86,17.77 0 top
R7  11.2,33.34 0 top
R8  21.78,11.46 90 top
R9  8.34,15.96 90 top
R10  22.95,14.79 0 top
R11  56.39,33.58 90 top
R12  58.49,33.61 90 top
R13  21.34,32.39 0 top
R14  59.05,22.01 180 top
R15  59.03,23.75 180 top
R20  26.46,11.46 270 top
R21  21.33,24.24 270 top
R22  14.85,30.96 0 top
R23  7.47,10.71 180 top
R24  13.53,28.35 180 top
R25  13.53,26.49 180 top
R26  7.53,22.44 0 top
R27  11.13,30.93 180 top
S1  4.97,35.7 0 top
U$1  43.05,27.27 0 top
USB1  68.66,27.5 90 top
USB2  68.66,16.37 90 top
USB3  0.06,27.09 270 top
X_8M  25.1,26.7 270 top
X_32KHZ  27.3,34.37 90 top
Y1  15.24,8.79 0 top

### Tracks (layer width: path | path; a pad name or v marks a point on that pad's centre or on a via)
+3V3  (via drill 0.55)
  Top 0.25: 12.8,13.72 IC6.48 | IC6.1 12.79,13.7 | 17.94,19.08 18.08,19.22 IC6.24 21.73,19.22 22.23,18.72 22.99,18.72 C26.2 | 12.85,19.08 12.79,19.14 IC6.36 12.62,20.89 8.76,20.89 C27.2 | 40.62,26.37 40.43,26.18 IC2.19 40.43,19.23 39.87,18.66 C3.1 38.77,18.66 38.01,17.91 v38.01,16.98 | 45.99,26.37 46.93,25.43 IC2.32 46.93,22.93 47.08,22.78 47.85,22.78 | 45.99,32.07 47.04,33.12 IC2.48 49.47,33.66 49.47,37.02 C5.1 | 40.17,32.13 40.17,33.18 39.43,33.92 IC2.64 38.56,35.12 37.67,36.01 C4.1 | 47.85,22.78 48.82,22.78 49.68,21.92 49.68,19.05 49.3,18.66 C6.1 | POWER.4 35.56,2.92 40.5,7.86 46.53,7.86 51.15,12.48 51.15,16.24 52.08,17.17 52.08,19.35 v52.53,19.8 | v47.85,23.19 47.85,22.78 | R4.1 32.63,11.42 v32.88,11.67 | R3.1 32.72,17.92 31.65,18.99 28.2,18.99 27.9,18.69 27.9,16.26 26.93,15.29 JP2.1
  Top 0.254: v23.18,36.66 C20.+ | IC6.9 16.79,13.32 17.94,14.47 | 12.79,13.7 12.79,13.71 12.8,13.72
  Top 0.508: 17.94,14.47 17.94,19.08 12.85,19.08 12.85,13.76 12.79,13.7 11.63,12.54 C23.2 | 22.1,16.11 22.1,16.79 23.01,17.7 C26.2 24.02,18.74 24.51,19.23 24.51,21.54 22.83,23.22 22.83,31.75 R13.2 22.19,33.55 21.8,33.95 | 22.1,16.11 R10.1 22.1,14.45 21.63,13.98 21.63,12.46 R8.2 | 40.62,26.37 45.99,26.37 45.99,32.07 45.99,32.13 40.17,32.13 40.08,32.13 40.08,26.46 40.17,26.37 40.53,26.37 | C4.1 35.84,37.91 32.67,41.07 29.64,41.07 29.05,40.48 JP4.2 | v26.79,39.75 26.79,38.7 24.75,36.66 C20.+ 23.34,35.49 21.8,33.95 | 21.8,33.95 21.43,34.31 v18.6,34.31 IC4.5 | R7.2 12.07,33.32 v12.15,33.32 12.24,33.41 | R27.1 v12.05,30.93 v12.06,30.92 | JP2.1 26.05,15.29 25.2,16.14 22.13,16.14 22.1,16.11
  Bottom 0.25: v47.85,23.19 48.3,23.19 51.69,19.8 v52.53,19.8 | R3.1 37.23,17.77 v38.01,16.98 | v32.88,11.67 32.73,11.67 32.58,11.52 27.63,11.52 27.06,12.09 27.06,14.78 JP2.1
  Bottom 0.254: CLS_5.1 13.71,48.7 13.71,42.09 14.73,41.07 22.29,41.07 22.85,40.51 22.85,39.54 21.96,38.65 21.96,37.23 22.53,36.66 v23.18,36.66
  Bottom 0.508: JP4.2 27.34,39.2 v26.79,39.75 | v18.6,34.31 13.14,34.31 v12.15,33.32 12.15,31.01 v12.06,30.92
  other vias: 32.72,17.77 29.05,39.2
+5V  (via drill 0.55)
  Top 0.25: v11.4,27.39 11.37,27.42 IC7.5 | IC5.5 v56.95,27.19 v56.94,27.18 | USB3.1 5.65,28.39 6.18,28.92 6.18,30.77 C25.2 | 59.14,19.02 IC8.8 v60.15,18.98 | v60.15,18.98 60.2,18.93 IC8.7 | USB2.1 63.22,15.07 62.58,14.43 v62.58,14.04 | USB1.1 63.28,26.2 62.85,25.77 62.85,21.89 C18.1 62.02,21.79 60.15,19.92 v60.15,18.98
  Top 0.254: 17.31,40.08 17.43,40.08 | 17.4,40.2 17.84,39.77 17.84,39.67 | IC8.8 v60.15,18.98
  Top 0.508: v59.52,30.36 60.13,30.36 C14.1 60.23,36.9 60.39,37.05 v60.39,37.08 | POWER.5 38.1,4.32 40.71,6.93 46.89,6.93 51.96,12 51.96,15.69 52.92,16.65 52.92,18.27 55.02,20.37 55.02,24.84 55.47,25.29 57.09,25.29 57.09,25.27 v57.21,25.15 | v60.54,43.14 60.24,42.84 v54.9,42.84 | v55.53,48.54 55.5,48.57 48.39,48.57 47.82,48 v47.76,48 | v41.94,47.43 41.34,47.43 40.2,48.57 30.33,48.57 30.24,48.66 v30.18,48.6 | C25.2 6.02,31.92 v5.67,31.92 | IC4.3 15.87,37.28 15.87,38.07 v15.57,38.37 16.02,38.82 16.05,38.82 17.31,40.08 | 17.43,43.18 17.4,43.15 17.4,40.2 17.28,40.08 | IC4.1 18.57,37.34 18.57,38.94 17.84,39.67 17.43,40.08 | IC1.TAB 21.11,44.51 23.43,46.83 24.63,46.83 v24.66,46.8
  Top 1.016: IC1.TAB 17.43,43.18 | 17.43,43.18 IC1.2 | C17.1 C16.1 17.6,43.35 17.43,43.18
  Bottom 0.25: v62.58,14.04 60.9,14.04 60.15,14.79 v60.15,18.98
  Bottom 0.508: 60.03,30.36 60.03,28.17 59.04,27.18 v56.94,27.18 57.03,27.09 57.03,25.33 v57.21,25.15 | 60.03,30.36 v59.52,30.36 | C18.1 62.88,21.78 62.88,29.7 62.22,30.36 60.03,30.36 | v60.39,37.08 60.39,42.99 v60.54,43.14 | v54.9,42.84 55.68,43.62 55.68,48.39 v55.53,48.54 | v47.76,48 47.19,47.43 v41.94,47.43 | v5.67,31.92 5.67,31.8 7.53,29.94 7.53,29.7 | v11.4,27.39 8.97,27.39 7.53,28.83 7.53,29.7 | 7.53,29.7 10.29,32.46 10.29,33.9 10.26,33.93 10.26,34.68 11.49,35.91 11.49,37.98 11.88,38.37 v15.57,38.37 | v30.18,48.6 30.18,48.06 28.92,46.8 v24.66,46.8
  other vias: 62.95,21.79
AN5
  Top 0.25: JP6.2 53.16,9.54 52.86,9.24 52.86,7.23 55.23,4.86 59.19,4.86 60.69,3.36 60.69,2.81 ANALOG_IN.5
AN6
  Top 0.25: JP9.2 59.76,9.54 60.3,9 60.3,6.15 63.5,2.95 ANALOG_IN.6
BOOT0  (via drill 0.55)
  Top 0.25: IC2.60 41.43,42.51 40.95,42.99 37.05,42.99 35.97,41.91 29.1,41.91 27.96,40.77 27.96,38.55 24.54,35.13 24.54,31.14 23.85,30.45 23.85,23.61 26.28,21.18 v27.69,21.18
  Bottom 0.25: v27.69,21.18 27.82,21.18 29.29,19.71 29.29,17.37 31.44,15.22 JP1.4
BOOT1
  Top 0.25: IC2.28 44.93,19.84 46.23,18.54 46.23,16.77 47.04,15.96 47.04,13.95 46.14,13.05 36.39,13.05 35.49,13.95 32.28,13.95 31.62,13.29 JP1.3
D2_N
  Top 0.25: IC5.6 56.68,26.24 55.98,26.94 55.41,26.94 54.76,27.59 54.76,28.38 56.01,29.63 56.61,29.63 57.19,30.21 57.19,30.88 56.39,31.68 R11.1
D2_P
  Top 0.25: IC5.4 56.69,28.14 56,27.44 55.62,27.44 55.26,27.8 55.26,28.17 56.22,29.13 56.82,29.13 57.69,30 57.69,30.91 58.49,31.71 R12.1
D3_N
  Top 0.25: R11.2 56.39,35.48 57.19,36.28 57.19,37.16 56.7,37.65 55.8,37.65 55.08,36.93 55.08,33.45 52.74,31.12 49.53,31.12 IC2.44
D3_P
  Top 0.25: R12.2 58.49,35.51 57.69,36.31 57.69,37.37 57.06,38.01 | 57.06,38.01 | 57.06,38.01 56.91,38.15 55.59,38.15 55.44,38.01 | 55.44,38.01 | 55.44,38.01 54.58,37.14 54.58,33.66 52.54,31.62 IC2.45
D_N
  Top 0.25: IC5.1 62.38,26.24 62.99,26.85 USB1.2
D_P
  Top 0.25: IC5.3 62.32,28.14 62.96,27.5 USB1.3
DW_N
  Top 0.25: R24.1 15.43,28.35 16.11,27.67 17.2,27.67 17.85,27.03 | 17.85,27.03 | 17.85,27.03 17.99,26.88 17.99,25.44 17.85,25.29 | 17.85,25.29 | IC6.32 14.79,22.24 17.85,25.29
DW_P
  Top 0.25: R25.1 15.43,26.49 16.11,27.17 16.99,27.17 17.49,26.67 17.49,25.65 14.29,22.45 14.29,21.32 IC6.33
F3SWCLK  (via drill 0.55)
  Top 0.25: v10.41,19.65 10.84,19.22 IC6.37
  Bottom 0.25: v10.41,19.65 10.18,19.88 8.55,19.88 JP3.1
F3SWDIO  (via drill 0.55)
  Top 0.25: IC6.34 13.79,23.35 13.38,23.76 11.46,23.76 10.21,22.52 v10.21,22.27
  Bottom 0.25: v10.21,22.27 9.25,21.31 7.44,21.31 JP3.2
GND  (via drill 0.55)
  Top 0.25: IC7.2 6.77,27.42 v6.74,27.39 | USB3.5 5.44,25.79 6.68,24.55 R26.1 | IC2.31 46.43,22.48 C6.2 48.5,21.4 v48.48,21.42 | IC2.18 39.93,20.98 C3.2 38.77,20.41 38.58,20.61 v38.56,20.59 | IC2.12 35.94,27.62 33.02,24.7 C1.1 | 31.25,28.9 C2.1 | IC2.47 50.83,32.62 51.36,33.15 51.36,38.01 50.53,38.84 C5.2 48.88,38.84 47.97,37.92 47.97,36.14 v48.23,35.88 | IC2.63 39.93,38.7 38.98,39.66 C4.2 | IC8.3 58.58,15.88 58.38,16.08 | C7.1 C8.1 | IC6.47 10.08,14.22 9.96,14.34 v9.75,14.13 | C27.1 v8.37,17.19 8.34,17.16 R9.2 | IC6.23 20.91,18.72 21.39,18.24 v21.39,18.15 | C26.1 22.54,20.91 21.96,20.91 v21.78,20.73 | IC6.35 13.29,22.62 13.05,22.86 12.63,22.86 v12.51,22.74 | IC5.2 61.39,27.19 v61.41,27.21 | USB1.5 62.46,28.8 61.98,29.27 C14.2 61.98,31.93 v62.01,31.95 | USB2.5 63.3,17.67 62.64,18.33 62.64,20.07 63.15,20.58 64.47,20.58 64.77,20.88 64.77,21.73 C18.2
  Top 0.254: LED1.C 17.23,32.49 v16.52,32.49 | v17.69,29.67 18.03,29.67 18.69,30.33 LED6.C | C11.2 29.02,37.12 30.77,35.38 C7.1 | IC6.8 16.29,13.41 v15.87,13.83 | IC2.12 38.29,27.62 39.18,26.73 39.18,25.38 39.57,24.99 39.93,24.99 IC2.18 | IC8.M 60.3,13.68 v60.3,13.11 | IC1.1 15.47,45.49 15.51,45.45 14.75,45.45 v14.72,45.48 | C15.2 12.13,39.21 11.1,39.21 10.27,38.38 C12.1 | v57,17.01 57,16.98 IC8.EXP 57.9,16.08 58.38,16.08 | C25.1 v7.72,31.61 v7.73,31.62 | C19.2 61.05,24.95 60.96,25.05 61.52,25.05 C19.2 | C19.2 v61.61,24.98 v61.62,24.99 | C2.1 30.8,28.9 v30.86,28.83 | J1.GND 2.19,44.88 2.19,45.18 2.39,44.98 J1.GND
  Top 0.508: IC4.2 v17.19,38.07 | C20.- v20.19,36.66 | R26.1 6.68,22.04 v6.63,21.99 | R9.2 7.72,16.81 7.23,16.32 7.23,16.2 | 17.61,52.32 17.37,52.08 17.37,49.32 17.49,49.2 19.11,49.2 19.3,49.01 C16.2 19.73,47.8 v19.73,48.03 | v11.7,1.08 v11.7,3.54 | v63.21,36.12 63.56,36.47 63.97,36.47 64.96,37.46
  Top 1.016: v12.14,47.97 12.75,47.36 C17.2 13.89,46.08 14.46,45.51 14.89,45.51 IC1.1 | C12.1 9.03,37.16 S1.2 | C21.2 13.4,37.12 v13.29,37.23 | J1.GND 2.39,43.04 1.47,42.12 1.47,38.21 S1.1
  Bottom 0.508: v19.73,48.03 18.9,48.86 18.9,49.14 18.87,49.17 17.49,49.17 17.37,49.29 17.37,52.08 | v63.21,36.12 63.29,36.2 63.69,36.2 65.64,38.15 v65.64,38.19 | v11.7,1.08 11.7,2.91
  other vias: 29.02,22.6 30.77,24.7 65.44,21.8 58.14,15.9 52.62,10.65 15.42,16.56 44.31,29.34 33.59,19.63 30.71,17.77 39.24,37.5 30.77,33.3 9.05,29.55 23.73,13.02 26.11,20.05 36,36.3 3.59,35.97 6.44,34.71 61.71,29.13 56.88,23.61 16.14,1.05 48.12,4.5 58.89,37.98 3.42,22.32 24.5,17.5 63.63,5.73 63.96,11.01 48.15,2.04 62.61,20.19
  pour Top (isolate 0.406): -0.3,53.82 68.1,53.82 69.15,52.77 69.15,1.77 66.24,-1.14 -0.93,-1.14 -1.59,-0.48 -1.59,52.68 -0.63,53.64
  pour Bottom (isolate 0.406): -0.3,53.82 68.1,53.82 69.15,52.77 69.15,1.77 66.24,-1.14 -0.93,-1.14 -1.59,-0.48 -1.59,52.68 -0.63,53.64
LED_STLINK  (via drill 0.55)
  Top 0.25: IC6.30 15.79,22.06 16.2,22.47 16.29,22.47 v16.32,22.44
  Bottom 0.25: v16.32,22.44 16.14,22.44 14.94,23.64 14.94,30.02 R22.1
  other vias: 14,30.96
MISO  (via drill 0.55)
  Top 0.25: 31.32,50.62 DIGITAL_PIN_8-13.5 | IC2.56 43.43,44.23 42.39,45.27 32.88,45.27 32.49,44.88 v32.37,44.88
  Bottom 0.25: v32.37,44.88 31.5,45.75 DIGITAL_PIN_8-13.5
MOSI/PWM6  (via drill 0.55)
  Top 0.25: IC2.57 42.93,43.92 42.18,44.67 34.41,44.67 33.81,44.07 33.81,44.04 v33.87,43.98
  Bottom 0.25: 33.87,45.12 v33.87,43.98
  Bottom 0.254: DIGITAL_PIN_8-13.4 34.04,50.56 32.49,49.01 32.49,46.5 33.87,45.12
N$1
  Top 0.25: 34.23,10.75 34.25,10.73 | 34.25,10.73 R4.2 | JP1.5 34.25,12.59 34.25,10.73
N$2
  Top 0.25: X_8M.2 25.51,24.7 C1.2 29.02,26.77 R1.2
N$3
  Top 0.25: 34.23,17.58 R3.2 34.44,17.75 34.44,16.5 34.16,16.22 JP1.6
N$4
  Top 0.25: R2.2 26.84,31 25.47,32.37 25.47,35.04 26.34,35.91 27.03,35.91 X_32KHZ.2 27.64,35.3 C7.2
N$5  (via drill 0.55)
  Top 0.25: IC8.6 61.09,17.38 61.62,17.91 v61.62,18.99 | v59.9,21.23 R14.1 59.99,21.92 60.77,21.92 61.61,22.76 C19.1
  Bottom 0.25: v61.62,18.99 61.62,19.5 v59.9,21.23
N$6
  Top 0.25: IC6.5 14.79,10.71 13.08,9 Y1.1 11.11,8.79 C13.2
N$7
  Top 0.25: IC6.7 15.79,10.88 16.32,10.35 21.52,10.35 R8.1 23.7,10.61 C24.2
N$8
  Top 0.25: IC6.6 15.29,10 16.5,8.79 Y1.2 17.44,8.75 C22.2
N$9
  Top 1.016: F1.1 12.18,43.79 C15.1 14.82,40.96 IC1.3
N$10
  Top 0.25: IC6.44 9.72,15.72 9.11,15.11 R9.1
N$11
  Top 0.25: LED1.A 20.37,32.51 R13.1
N$12  (via drill 0.55)
  Top 0.25: IC6.10 17.29,11.33 17.65,10.97 19.34,10.97 v20.07,11.7 v20.07,11.71 | R20.1 26.42,12.31 v25.68,13.05 25.54,13.05 R10.2
  Bottom 0.25: v20.07,11.71 25.39,11.71 25.65,11.97 25.65,13.02 v25.68,13.05
N$13
  Top 0.25: IC6.25 20.3,20.72 21.33,21.75 R21.2
N$14
  Top 0.25: R22.2 LED6.A
N$15
  Top 0.25: IC6.2 13.29,10.98 12.99,10.68 8.35,10.68 R23.1
N$16
  Top 0.25: R14.2 58.2,21.36 58.6,20.96 IC8.9
N$17  (via drill 0.55)
  Top 0.25: IC8.11 57.6,19.92 57.38,20.14 v57.38,20.6 | v59.91,23.79 v59.91,23.78 R15.1
  Bottom 0.25: v59.91,23.79 59.13,23.79 57.42,22.08 57.42,20.65 v57.38,20.6
N$18
  Top 0.25: IC7.6 12.66,28.37 R24.2
N$19
  Top 0.25: IC8.26 58.1,12.76 58.86,12 60.74,12 61.61,11.13 61.57,11.09 JP5.4
  Top 0.254: IC8.26 58.1,12.76
N$20
  Top 0.25: IC8.25 57.6,11.79 58.68,10.71 JP5.2
N$21
  Top 0.25: IC7.4 12.66,26.47 R25.2
N$22
  cutout Top: 0.36,52.08 3.03,52.08 3.03,49.62 2.97,49.56 0.39,49.56 0.36,49.59 0.36,52.11
  cutout Bottom: 0.36,52.08 3.03,52.08 3.03,49.62 2.97,49.56 0.39,49.56 0.36,49.59 0.36,52.11
  cutout Bottom: 5.25,52.08 12.84,52.08 12.84,49.56 5.28,49.56 5.25,49.59 5.25,52.11
  cutout Top: 5.28,52.08 12.84,52.08 12.84,49.56 5.31,49.56 5.28,49.59 5.28,52.11
  cutout Top: 17.76,52.05 25.29,52.05 25.29,49.53 17.76,49.53
  cutout Bottom: 27.6,52.02 42.9,52.02 42.9,49.5 27.63,49.5 27.6,49.53 27.6,52.05
  cutout Top: 27.6,52.02 42.9,52.02 42.9,49.5 27.63,49.5 27.6,49.53 27.6,52.05
  cutout Bottom: 17.76,52.05 25.29,52.05 25.29,49.53 17.76,49.53
N$23
  Top 0.25: IC7.1 6.38,28.37 5.75,27.74 USB3.2
N$24
  cutout Bottom: 2.79,39.66 9.69,39.66 10.05,40.02 10.05,46.74 9.33,47.46 9.24,47.55 5.94,47.55 4.56,46.17 4.56,44.16 2.4,42 2.4,40.23 2.4,40.08 2.79,39.69
  cutout Top: 2.79,39.66 9.69,39.66 10.05,40.02 10.05,46.74 9.33,47.46 9.24,47.55 5.94,47.55 4.56,46.17 4.56,44.16 2.4,42 2.4,40.23 2.4,40.08 2.79,39.69
N$25
  cutout Top: 15.75,36.39 18.51,36.39 18.63,36.27 18.63,33.93 18.57,33.87 15.9,33.87 15.72,34.05 15.72,36.36
N$26
  cutout Top: 21.09,37.35 21.09,36 21.12,35.97 23.07,35.97 23.13,36.03 23.13,37.32 21.15,37.32 21.09,37.38
N$27
  cutout Top: 15.15,46.77 15.15,39.96 15.42,39.69 19.95,39.69 22.17,41.91 22.17,45.06 20.43,46.8 15.21,46.8
  cutout Bottom: 15.15,46.77 15.15,39.96 15.42,39.69 19.95,39.69 22.17,41.91 22.17,45.06 20.43,46.8 15.21,46.8
N$28
  cutout Bottom: 44.49,51.93 63.63,51.93 64.62,50.94 64.62,38.37 63.24,36.99 62.31,36.99 62.31,49.08 61.95,49.44 44.52,49.44 44.43,49.53 44.43,51.84 44.49,51.9
  cutout Top: 44.49,51.93 63.63,51.93 64.62,50.94 64.62,38.4 63.21,36.99 62.31,36.99 62.31,49.08 61.95,49.44 44.52,49.44 44.43,49.53 44.43,51.84 44.49,51.9
N$29
  cutout Top: 57.9,11.82 62.55,11.82 62.55,6.96 57.9,6.96
  cutout Bottom: 57.93,11.85 62.56,11.85 62.56,6.96 57.93,6.96
N$30
  cutout Top: 28.14,16.56 35.1,16.56 35.49,16.17 35.49,12 35.07,11.58 28.17,11.58 27.9,11.85 27.9,16.35 28.05,16.5
  cutout Bottom: 28.14,16.59 35.1,16.59 35.49,16.2 35.49,12.03 35.07,11.61 28.17,11.61 27.9,11.88 27.9,16.38 28.05,16.53
N$31
  cutout Top: 32.34,23.04 34.71,23.04 34.92,22.83 34.92,20.13 34.65,19.86 32.43,19.86 32.37,19.92 32.25,20.04 32.25,22.98
N$32
  cutout Bottom: 64.77,3.99 55.47,3.9 49.86,3.9 49.56,3.6 49.56,1.47 49.77,1.26 64.77,1.26
  cutout Top: 64.77,3.99 56.07,3.99 49.92,3.99 49.56,3.63 49.56,1.5 49.8,1.26 64.77,1.26
N$33
  Top 0.25: R5.1 28.75,12.42 28.82,12.42 JP1.1
N$34
  Top 0.25: R6.1 29.01,15.66 29.01,15.5 29.01,15.29 JP1.2
N$35
  cutout Top: 16.65,3.75 39.09,3.75 39.45,3.39 39.45,1.47 39.18,1.2 16.77,1.2 16.65,1.32
  cutout Bottom: 16.65,3.72 39.15,3.72 39.45,3.42 39.45,1.5 39.18,1.23 16.77,1.23 16.65,1.35
N$36
  cutout Top: 44.76,3.99 46.98,3.99 46.98,1.29 46.92,1.23 44.9,1.25 44.55,1.59 44.55,3.81 44.64,3.9
  cutout Bottom: 44.79,3.93 46.74,3.93 46.98,3.69 46.98,1.29 44.95,1.33 44.55,1.74 44.55,3.69
N$37
  cutout Top: 10.8,3.84 5.13,3.84 3.96,5.01 3.96,21.12 1.35,21.12 1.35,4.32 1.44,4.23 1.44,1.41 1.59,1.26 10.8,1.26
  cutout Bottom: 10.8,3.84 5.13,3.84 3.96,5.01 3.96,21.09 1.35,21.09 1.35,4.32 1.44,4.23 1.44,1.41 1.56,1.29 10.8,1.29
N$38
  cutout Top: 11.97,37.11 14.34,37.11 14.43,37.02 14.43,35.64 14.4,35.61 12.24,35.61 12.24,36.99 12.27,37.02
N$39  (via drill 0.55)
  other vias: 18.42,45.45
N$40  (via drill 0.55)
  Top 0.25: USB3.3 5.76,27.09 6.38,26.47 IC7.3 8.22,26.09 v8.22,25.35 | R27.2 10.26,30.91 v10.26,30.27
  Bottom 0.254: v8.22,25.35 13.32,25.35 13.86,25.89 13.86,29.46 13.62,29.7 10.29,29.7 10.26,29.73 v10.26,30.27
N$41  (via drill 0.55)
  other vias: 20.19,45.48
N$42  (via drill 0.55)
  other vias: 21.63,45.48
N$43
  cutout Top: 29.1,40.09 29.1,32.67 30.24,32.67 31.11,33.54 31.11,39.89
N$44
  cutout Top: 28.98,31.02 30.81,31.02 30.84,30.99 30.84,20.28 28.98,20.28 28.89,20.37 28.89,30.96 28.95,31.02
N$45
  Top 0.25: USB3.4 5.69,26.44 8.38,23.75 R26.2
N$46  (via drill 0.55)
  other vias: 18.42,42.21
N$47  (via drill 0.55)
  other vias: 20.07,42.15
N$48
  cutout Top: 63.6,31.32 68.46,31.32 68.67,31.11 68.67,23.82 68.58,23.73 63.63,23.73 63.54,23.82 63.54,31.29 63.6,31.35
  cutout Bottom: 63.51,31.32 68.37,31.32 68.58,31.11 68.58,23.82 68.49,23.73 63.54,23.73 63.45,23.82 63.45,31.29 63.51,31.35
  cutout Bottom: 63.69,20.13 68.55,20.13 68.76,19.92 68.76,12.63 68.67,12.54 63.72,12.54 63.63,12.63 63.63,20.1 63.69,20.16
  cutout Top: 63.69,20.16 68.55,20.16 68.76,19.95 68.76,12.66 68.67,12.57 63.72,12.57 63.63,12.66 63.63,20.13 63.69,20.19
  cutout Top: 4.14,23.31 0.09,23.31 -0.09,23.49 -0.09,30.78 0,30.87 4.95,30.87 5.04,30.78 5.04,24.21
  cutout Bottom: 4.17,23.34 0.03,23.34 -0.09,23.46 -0.09,30.75 0,30.84 4.95,30.84 5.01,30.78 5.01,24.18
N$49
  cutout Top: 29.28,18.33 30.45,18.33 30.57,18.21 30.57,17.37 30.48,17.28 29.28,17.28 29.28,18.27
N$50
  cutout Top: 24.72,31.32 28.29,31.32 28.8,30.81 28.8,21.69 28.68,21.57 24.15,21.57 23.43,22.29 23.43,30.03
N$53  (via drill 0.55)
  other vias: 21.63,42.18
N$55
  Top 0.508: C21.1 14.28,35.1 15.07,34.31 IC4.4
NRST  (via drill 0.55)
  Top 0.25: IC2.7 34.83,30.12 v34.47,30.48 | POWER.3 33.02,2.69 36.3,5.97 37.59,5.97 40.44,8.82 45.36,8.82 v45.42,8.76
  Top 0.254: v21.51,29.52 20.4,28.41 17.04,28.41 v16.02,29.43 | R7.1 10.35,32.58 10.77,32.16 12.93,32.16 13.56,32.79 14.59,32.79 v14.97,32.41
  Top 0.508: C12.2 10.27,33.42 | 10.27,33.42 R7.1 | 10.27,33.42 10.25,33.44 S1.4 S1.3
  Bottom 0.25: v34.47,30.48 34.44,30.45 33.36,30.45 32.64,29.73 32.64,28.02 31.8,27.18 | v45.42,8.76 47.41,10.75 47.41,15.56 44.81,18.17 37.87,18.17 35.38,20.66 35.38,21.5 31.53,25.35
  Bottom 0.254: v16.02,29.43 15.84,29.61 15.84,31.5 15.09,32.25 14.97,32.25 v14.97,32.41 | v21.51,29.52 22.62,29.52 23.97,30.87 26.19,30.87 26.76,30.3 26.76,27.96 27.54,27.18 28.05,27.18 29.31,28.44 29.31,29.28 30.42,30.39 31.98,30.39 32.64,29.73 | 31.8,27.18 31.53,26.91 31.53,25.35
OSC_IN  (via drill 0.55)
  Top 0.25: IC2.5 35.93,31.12 35.13,31.92 33.57,31.92 33.07,31.42 v32.58,31.42 | C2.2 28.48,28.9 28.48,28.91 28.43,28.91 v27.98,29.36 27.68,29.05 25.16,29.05 X_8M.1
  Bottom 0.25: v32.58,31.42 32.5,31.5 28.86,31.5 27.98,30.61 v27.98,29.36
OSC_OUT
  Top 0.25: IC2.6 35.62,30.62 34.89,31.35 34.08,31.35 32.46,29.73 32.46,27.78 31.44,26.76 30.79,26.76 R1.1
PA0  (via drill 0.55)
  Top 0.25: IC2.14 36.43,26.62 35.45,25.64 35.45,21.49 36.27,20.67 36.27,15.84 v37.53,14.58
  Bottom 0.25: CLS_1.7 3.73,20.36 4.59,19.5 4.59,16.59 10.47,10.71 36.18,10.71 37.68,12.21 37.68,14.61 37.56,14.61 v37.53,14.58
PA1  (via drill 0.55)
  Top 0.25: IC2.15 36.74,26.12 36.27,25.65 36.27,24.35 v36.44,24.18
  Bottom 0.25: ANALOG_IN.2 53.34,3.06 48.72,7.68 48.72,16.11 45.36,19.47 41.7,19.47 36.99,24.18 v36.44,24.18
PA2  (via drill 0.55)
  Top 0.25: IC2.16 37.43,23.12 36.72,22.41 v36.51,22.41
  Bottom 0.25: v36.51,22.41 36.51,20.49 38.16,18.84 45.06,18.84 48.1,15.8 48.1,7.31 50.8,4.61 ANALOG_IN.1
PA3  (via drill 0.55)
  Top 0.25: v38.49,15.54 37.83,15.54 36.99,16.38 36.99,21.39 39.22,23.62 IC2.17
  Bottom 0.25: CLS_1.6 2.54,17.58 10,10.12 37.48,10.12 38.51,11.15 38.51,15.52 v38.49,15.54
PA4  (via drill 0.55)
  Top 0.25: v39.39,16.68 40.11,16.68 40.93,17.5 IC2.20
  Bottom 0.25: CLS_1.5 3.5,15.28 9.24,9.54 38.04,9.54 39.39,10.89 v39.39,16.68
PA5  (via drill 0.55)
  Top 0.25: IC2.21 41.43,17.04 40.32,15.93 v40.32,15.69
  Bottom 0.25: CLS_1.4 4.63,12.74 8.4,8.97 38.52,8.97 40.32,10.77 v40.32,15.69
PA6  (via drill 0.55)
  Top 0.25: IC2.22 41.93,16.28 v41.55,15.9
  Bottom 0.25: CLS_1.3 6.12,10.2 7.92,8.4 39,8.4 41.55,10.95 v41.55,15.9
PA7  (via drill 0.55)
  Top 0.25: IC2.23 42.43,15.08 v42.48,15.03
  Bottom 0.25: CLS_1.2 2.68,7.8 39.36,7.8 42.45,10.89 42.45,15 v42.48,15.03
PA8/PWM2  (via drill 0.55)
  Top 0.25: IC2.41 53.57,29.62 53.94,29.25 54.01,29.25 v54.03,29.27
  Bottom 0.25: v54.03,29.27 53.43,29.87 53.43,47.1 50.8,49.73 DIGITAL_PIN_0-7.6
PB0  (via drill 0.55)
  Top 0.25: IC2.26 43.93,19.07 45.09,17.91 45.09,15.57 v45.15,15.51
  Bottom 0.25: CLS_2.3 5.09,3.92 7.14,5.97 40.23,5.97 45.15,10.89 v45.15,15.51
PB1  (via drill 0.55)
  Top 0.25: IC2.27 44.43,19.41 45.66,18.18 45.66,16.5 46.2,15.96 46.2,14.82 46.02,14.64 46.02,14.37 v46.05,14.34
  Bottom 0.25: CLS_2.2 6.97,3.2 6.97,4.57 7.74,5.34 40.53,5.34 46.05,10.86 v46.05,14.34
PB9/~/CANRX  (via drill 0.55)
  Top 0.25: IC2.62 40.43,41.32 40.02,41.73 39.12,41.73 38.91,41.52 v38.91,41.37
  Bottom 0.25: v38.91,41.37 37.05,43.23 37.05,46.74
  Bottom 0.254: 37.05,46.74 37.05,47.25 38.7,48.9 46.98,48.9 48.26,50.18 DIGITAL_PIN_0-7.7
PB10
  Top 0.25: CLS_2.1 10.17,3.84 13.41,7.08 22.65,7.08 | 33.54,8.97 35.64,8.97 39.02,12.35 46.34,12.35 47.91,13.92 47.91,15.96 46.79,17.08 46.79,18.79 45.43,20.15 IC2.29
  Top 0.254: 22.65,7.08 31.65,7.08 33.54,8.97
PB11
  Top 0.25: CLS_3.4 17.79,5.82 18.48,6.51 25.5,6.51 | 33.87,8.41 36.18,8.41 39.53,11.76 46.59,11.76 48.57,13.74 48.57,16.28 47.36,17.5 47.36,18.93 45.93,20.36 45.93,22.27 IC2.30
  Top 0.254: 25.5,6.51 31.97,6.51 33.87,8.41
PB12
  Top 0.25: CLS_3.3 20.33,5.27 20.94,5.88 25.95,5.88 | 34.2,7.74 36.39,7.74 39.78,11.13 46.86,11.13 49.3,13.57 49.3,17.23 50.28,18.21 50.28,24.27 IC2.33
  Top 0.254: 25.95,5.88 32.34,5.88 34.2,7.74
PB13
  Top 0.25: CLS_3.2 22.87,4.9 23.19,5.22 | 34.62,7.11 36.69,7.11 40.06,10.48 47.13,10.48 49.89,13.23 49.89,16.98 50.88,17.97 50.88,25.02 49.78,26.12 IC2.34
  Top 0.254: 34.62,7.11 32.73,5.22 23.19,5.22
PB14
  Top 0.25: CLS_3.1 25.41,2.61 27.34,4.54 | 35.79,6.54 37.08,6.54 40.38,9.84 47.43,9.84 50.52,12.93 50.52,16.6 51.47,17.55 51.47,25.18 50.03,26.62 IC2.35
  Top 0.254: 35.79,6.54 33.8,4.54 27.34,4.54
PB15  (via drill 0.55)
  Top 0.25: IC2.36 50.4,27.12 52.08,25.44 52.08,24 53.37,22.71 53.76,22.71 v53.82,22.65 | v49.86,44.64 49.98,44.64 50.49,44.13 59.64,44.13 61.26,45.75 CLS_4.4
  Bottom 0.25: v53.82,22.65 53.58,22.65 49.89,26.34 49.89,35.07 49.41,35.55 49.41,42.15 49.02,42.54 49.02,43.8 v49.86,44.64
PC0  (via drill 0.55)
  Top 0.25: IC2.8 34.6,29.62 34.31,29.33 v33.99,29.33 | JP9.1 56.64,7.8 v57.27,7.17
  Bottom 0.25: v33.99,29.33 36.37,29.33 43.8,21.9 46.41,21.9 51.39,16.92 51.39,9.27 52.11,8.55 55.62,8.55 57,7.17 v57.27,7.17
PC1  (via drill 0.55)
  Top 0.25: IC2.9 35.08,29.12 34.11,28.15 v33.62,28.15 | v55.11,7.26 54.63,7.74 JP6.1
  Bottom 0.25: v33.62,28.15 36.56,28.15 43.44,21.27 46.2,21.27 50.79,16.68 50.79,8.7 52.2,7.29 55.08,7.29 v55.11,7.26
PC2  (via drill 0.55)
  Top 0.25: IC2.10 35.4,28.62 33.69,26.91 v33.24,26.91
  Bottom 0.25: v33.24,26.91 36.54,26.91 42.75,20.7 45.93,20.7 50.1,16.53 50.1,8.19 53.25,5.04 57.27,5.04 58.42,3.89 ANALOG_IN.4
PC3  (via drill 0.55)
  Top 0.25: IC2.11 35.68,28.12 33.26,25.7 v32.51,25.7
  Bottom 0.25: v32.51,25.7 36.44,25.7 42.07,20.07 45.66,20.07 49.38,16.35 49.38,8.04 53.07,4.35 54.81,4.35 55.88,3.28 ANALOG_IN.3
PC4  (via drill 0.55)
  Top 0.25: IC2.24 42.93,18.21 43.29,17.85 v43.29,16.08
  Bottom 0.25: CLS_1.1 3.83,5.12 5.91,7.2 39.66,7.2 43.38,10.92 43.38,15.99 v43.29,16.08
PC5  (via drill 0.55)
  Top 0.25: IC2.25 43.43,18.7 44.19,17.94 v44.19,17.01
  Bottom 0.25: CLS_2.4 2.55,2.57 6.55,6.57 40.02,6.57 44.19,10.74 v44.19,17.01
PC6  (via drill 0.55)
  Top 0.25: IC2.37 50.71,27.62 52.8,25.53 52.8,24.96 53.73,24.03 v53.79,24.03 | v50.1,43.23 50.22,43.35 52.35,43.35 53.97,41.73 60.75,41.73 62.23,43.21 CLS_4.3
  Bottom 0.25: v53.79,24.03 50.61,27.21 50.61,38.97 50.01,39.57 50.01,43.14 v50.1,43.23
PC7  (via drill 0.55)
  Top 0.25: IC2.38 51.11,28.12 v53.79,25.44 | v51.33,42.33 51.87,42.33 53.31,40.89 63.28,40.89 CLS_4.2
  Bottom 0.25: v53.79,25.44 51.33,27.9 51.33,39.63 50.55,40.41 50.55,41.55 v51.33,42.33
PC8  (via drill 0.55)
  Top 0.25: IC2.39 51.9,28.62 52.98,27.54 52.98,27.27 53.52,26.73 v53.79,26.73 | v51.57,40.83 52.35,40.05 60.35,40.05 62.27,38.13 CLS_4.1
  Bottom 0.25: v53.79,26.73 53.55,26.73 51.99,28.29 51.99,40.17 51.57,40.59 v51.57,40.83
PC9/PWM3  (via drill 0.55)
  Top 0.25: IC2.40 52.69,29.12 53.79,28.02 v53.79,27.99 | v52.4,46.58 52.97,46.01 56.2,46.01 56.84,46.64 56.84,49.84 DIGITAL_PIN_0-7.4
  Bottom 0.25: v53.79,27.99 52.68,29.1 52.68,46.47 52.32,46.83 52.06,46.58 v52.4,46.58
PC10
  Top 0.25: DIGITAL_PIN_0-7.3 58.42,47.14 56.64,45.36 51.75,45.36 50.88,46.23 47.07,46.23 45.93,45.09 IC2.51
PC11  (via drill 0.55)
  Top 0.25: 50.73,46.89 46.92,46.89 45.43,45.4 IC2.52
  Top 0.254: 50.73,46.89 51.57,47.73 51.57,47.76 53.94,47.76 v54.48,47.22
  Bottom 0.254: v54.48,47.22 54.48,47.28 53.34,48.42 DIGITAL_PIN_0-7.5
PC12
  Top 0.25: IC2.53 44.93,46.76 45.72,47.55 DIGITAL_PIN_0-7.8
PC13  (via drill 0.55)
  Top 0.25: IC2.2 36.68,32.62 33.48,35.82 v32.85,35.82
  Top 0.254: v26.04,41.04 25.71,40.71 25.71,39.24 24.48,38.01 20.1,38.01 v19.77,38.34
  Bottom 0.254: v32.85,35.82 32.85,36.09 30.87,38.07 26.91,38.07 25.8,39.18 25.8,40.8 v26.04,41.04 | v19.77,38.34 19.77,38.38 18.83,39.32 13.09,39.32 11.39,41.02 11.39,45.29 8.32,48.36 2.28,48.36 1.39,49.25 CLS_5.5
PC14  (via drill 0.55)
  Top 0.25: IC2.3 36.43,32.12 34.23,34.32 v32.79,34.32
  Top 0.254: C8.2 27.5,33.3 X_32KHZ.1
  Bottom 0.25: v32.79,34.32 32.7,34.41 28.61,34.41 X_32KHZ.1
PC15
  Top 0.25: IC2.4 36.21,31.62 35.34,32.49 32.13,32.49 30.75,31.11 R2.1
PD2
  Top 0.25: 41.34,50.48 41.58,50.73 | 41.58,50.73 DIGITAL_PIN_8-13.1 | IC2.54 44.43,47.52 41.58,50.37 41.58,50.73
PWM4  (via drill 0.55)
  Top 0.25: IC2.61 40.93,41.84 40.35,42.42 37.68,42.42 36.96,41.7 36.96,41.64 v37.11,41.49
  Bottom 0.25: v37.11,41.49 35.58,43.02 35.58,47.07
  Bottom 0.254: 35.58,47.07 35.58,47.1 39.12,50.64 DIGITAL_PIN_8-13.2
RX  (via drill 0.55)
  Top 0.25: IC2.43 53.21,30.62 54.87,32.28 v55.03,32.12
  Bottom 0.25: DIGITAL_PIN_0-7.1 61.4,48.7 61.4,45.83 55.03,39.47 v55.03,32.12 55.3,32.12 55.8,31.62 55.8,15.06 57.63,13.23 57.63,10.38 58.56,9.45 60.33,9.45 61.57,8.21 JP5.3
SCK
  Top 0.25: IC2.55 43.93,44.57 42.45,46.05 30.84,46.05 28.96,47.93 DIGITAL_PIN_8-13.6
SCL  (via drill 0.55)
  Top 0.25: DIGITAL_PIN_8-13.10 21.12,48.48 27.18,48.48 32.61,43.05 35.16,43.05 36.24,44.13 41.67,44.13 42.43,43.37 IC2.58 42.43,34.07 43.05,33.45 v43.05,33.39 | v55.8,12.18 55.8,11.27 JP9.3
  Bottom 0.25: v43.05,33.39 43.05,32.91 42.3,32.16 42.3,27 44.04,25.26 48.09,25.26 51.6,21.75 52.89,21.75 54.66,19.98 54.66,13.71 55.8,12.57 v55.8,12.18
SDA  (via drill 0.55)
  Top 0.25: v21.42,47.51 21.68,47.24 22.27,47.83 26.75,47.83 32.03,42.55 35.71,42.55 36.69,43.53 41.46,43.53 41.93,43.06 IC2.59 41.93,33.73 42.03,33.63 v41.79,33.39 | v54.33,12.15 54.33,10.73 JP6.3
  Bottom 0.25: v21.42,47.51 21.42,50.72 DIGITAL_PIN_8-13.9 | v54.33,12.15 54.09,12.39 54.09,19.59 52.74,20.94 51.54,20.94 47.85,24.63 43.59,24.63 41.79,26.43 v41.79,33.39
SS/PWM5  (via drill 0.55)
  Top 0.25: v46.8,43.32 46.43,42.95 IC2.50
  Top 0.254: v39.39,47.13 34.17,47.13 34.08,47.22 v33.99,47.22
  Bottom 0.25: v46.8,43.32 46.65,43.17 40.26,43.17
  Bottom 0.254: 40.26,43.17 39.39,44.04 v39.39,47.13 | v33.99,47.22 36.58,49.81 DIGITAL_PIN_8-13.3
SWCLK  (via drill 0.55)
  Top 0.25: v47.34,38.7 46.93,38.29 IC2.49
  Bottom 0.25: v47.34,38.7 46.59,39.45 33.84,39.45 30.79,42.5 JP7.1
SWDIO  (via drill 0.55)
  Top 0.25: IC2.46 52.22,32.12 53.97,33.87 53.97,37.04 50.6,40.41 47.82,40.41 47.61,40.2 v47.61,40.17
  Bottom 0.25: v47.61,40.17 34.56,40.17 29.69,45.04 JP7.3
T_JTCK  (via drill 0.55)
  Top 0.25: IC6.26 17.79,22.14 18.51,22.86 v18.51,22.98 | JP7.2 24.98,42.32 24.98,42.08
  Top 0.254: v20.82,39.15 21.27,38.7 24.15,38.7 24.98,39.53 24.98,42.08
  Bottom 0.25: v18.51,22.98 21.27,22.98 21.99,23.7 21.99,27.15 | JP7.2 24.93,42.37 24.93,39.18
  Bottom 0.254: 21.99,27.15 20.52,28.62 20.52,30 21.33,30.81 22.32,30.81 25.44,33.93 25.44,35.52 26.07,36.15 26.07,38.04 24.93,39.18 | v20.82,39.15 20.12,39.85 13.58,39.85 11.96,41.48 11.96,45.62 6.71,50.86 CLS_5.3
T_JTMS  (via drill 0.55)
  Top 0.25: IC6.27 17.29,23.5 18.88,25.09 R21.1 21.33,25.56 v20.46,26.43 | JP7.4 24.65,44.89 24.31,44.89
  Top 0.254: v21.84,40.05 22.95,40.05 23.37,40.47 23.37,43.95 24.31,44.89
  Bottom 0.25: 24.09,41.19 24.12,41.16 24.12,39 | 21.11,31.61 19.89,30.39 19.89,27 v20.46,26.43 | JP7.4 24.73,44.97 24.63,44.97
  Bottom 0.254: CLS_5.2 9.01,49.36 12.76,45.61 12.76,41.84 14.12,40.48 21.5,40.48 21.84,40.14 v21.84,40.05 | 24.09,41.19 23.4,41.88 23.4,44.4 23.97,44.97 24.63,44.97 | 24.12,39 25.35,37.77 25.35,36.33 24.69,35.67 24.69,34.35 21.95,31.61 21.11,31.61
TX  (via drill 0.55)
  Top 0.25: IC2.42 53.73,30.12 54.36,30.75 v54.6,30.51
  Bottom 0.25: DIGITAL_PIN_0-7.2 60.33,50.17 60.33,45.99 54.06,39.72 54.06,31.05 v54.6,30.51 55.22,29.89 55.22,14.56 57,12.78 57,9.24 58.07,8.17 JP5.1
USB_N
  Top 0.25: IC8.5 61.27,16.88 62.43,15.72 USB2.2
USB_P  (via drill 0.55)
  Top 0.25: USB2.3 62.71,16.37 62.28,16.8 v62.28,17.16 | v61.72,15.22 61.72,15.72 61.06,16.38 60.9,16.38 IC8.4
  Top 0.254: IC8.4 60.9,16.38
  Bottom 0.25: v62.28,17.16 61.8,16.68 61.8,15.45 61.72,15.37 v61.72,15.22
VBAT  (via drill 0.55)
  Top 0.25: IC2.1 37.05,33.12 32.87,37.3 C11.1 30.75,37.33 JP4.1 31.57,39.2 31.92,38.85 v32.07,38.85 | v48.12,41.76 48.69,42.33 48.69,44.07 | CLS_4.5 60.77,48.29 57.24,44.76 51.16,44.76 50.3,45.62
  Top 0.254: 50.3,45.62 49.33,45.62 48.69,44.98 48.69,44.07
  Bottom 0.25: v32.07,38.85 45.15,38.85 46.38,37.62 47.7,37.62 48.66,38.58 48.66,41.22 v48.12,41.76
VDDA
  Top 0.25: IC2.13 36.18,27.12 33.63,24.57 C10.+ 31.36,23.19 C9.1 30.75,22.57 FB.2
VDDA_PIN  (via drill 0.55)
  Top 0.25: FB.1 28.75,20.1 27.75,20.1 26.55,18.9 JP2.2
  Top 0.254: v19.62,21.9 19.9,22.18 19.9,23.68 v19.54,24.04
  Bottom 0.25: 22.56,21.9 26.73,17.73 26.55,17.56 JP2.2
  Bottom 0.254: DIGITAL_PIN_8-13.8 23.88,48.75 22.77,47.64 22.77,41.52 23.4,40.89 23.4,38.67 24.48,37.59 24.48,36.39 23.91,35.82 23.91,34.86 21.72,32.67 | 21.63,32.67 21.72,32.67 | 21.72,32.67 21.69,32.64 21.03,32.64 19.23,30.84 19.23,24.35 v19.54,24.04 | v19.62,21.9 22.56,21.9
VIN  (via drill 0.55)
  Top 0.508: v9,4.08 6.78,4.08 4.5,6.36 4.5,21.54 v4.62,21.54
  Top 1.016: F1.2 9.23,45.52 J1.PWR
  Bottom 0.508: POWER.8 45.72,3.66 44.72,4.66 9.48,4.66 9,4.18 v9,4.08 | v4.62,21.54 4.62,21.78 5.79,22.95 5.79,25.86 5.31,26.34 5.31,28.05 6.21,28.95 6.21,29.76 4.26,31.71 4.26,34.44 5.85,36.03 9.15,36.03 10.17,37.05 10.17,42.9 J1.PWR
(copper drawn outside any net)
  shapes: Bottom area x1, Top area x1

### Text on the board
tNames: PD2/D8 | SCK | MISO/~ | MOSI/~ | SS/PWM | CANTX/~ | PC12/D7 | CANRX/~ | PA8/~ | PC11 | PC9/~ | PC10 | GND | SDA | SCL | PC1 | PC0 | NC | NC | NRST | 3.3V | 5V | GND | GND | VIN
bNames: SCL | SDA | VDDA | GND | PB3 | PB4 | PB5 | PA15 | PB8 | PD2 | PB9 | VBAT | TX | RX | PB15 | PC13 | GND | PA14/SWCLK | PA13/SWDIO | 3.3V | PC6 | PC7 | PC8 | PA0 | in partner with | PA3 | PA4 | PA5 | PC5 | PB0 | PB1 | PB10 | PA6 | PB11 | PB12 | PB13 | PB14 | PA7 | PA2 | PA1 | PC3 | PC2 | AN5 | AN6 | PC4